# EAGLE design puca-dsp-v1.2-PR (EAGLE 7.6.0)

## Sheet 1 of 3: Power
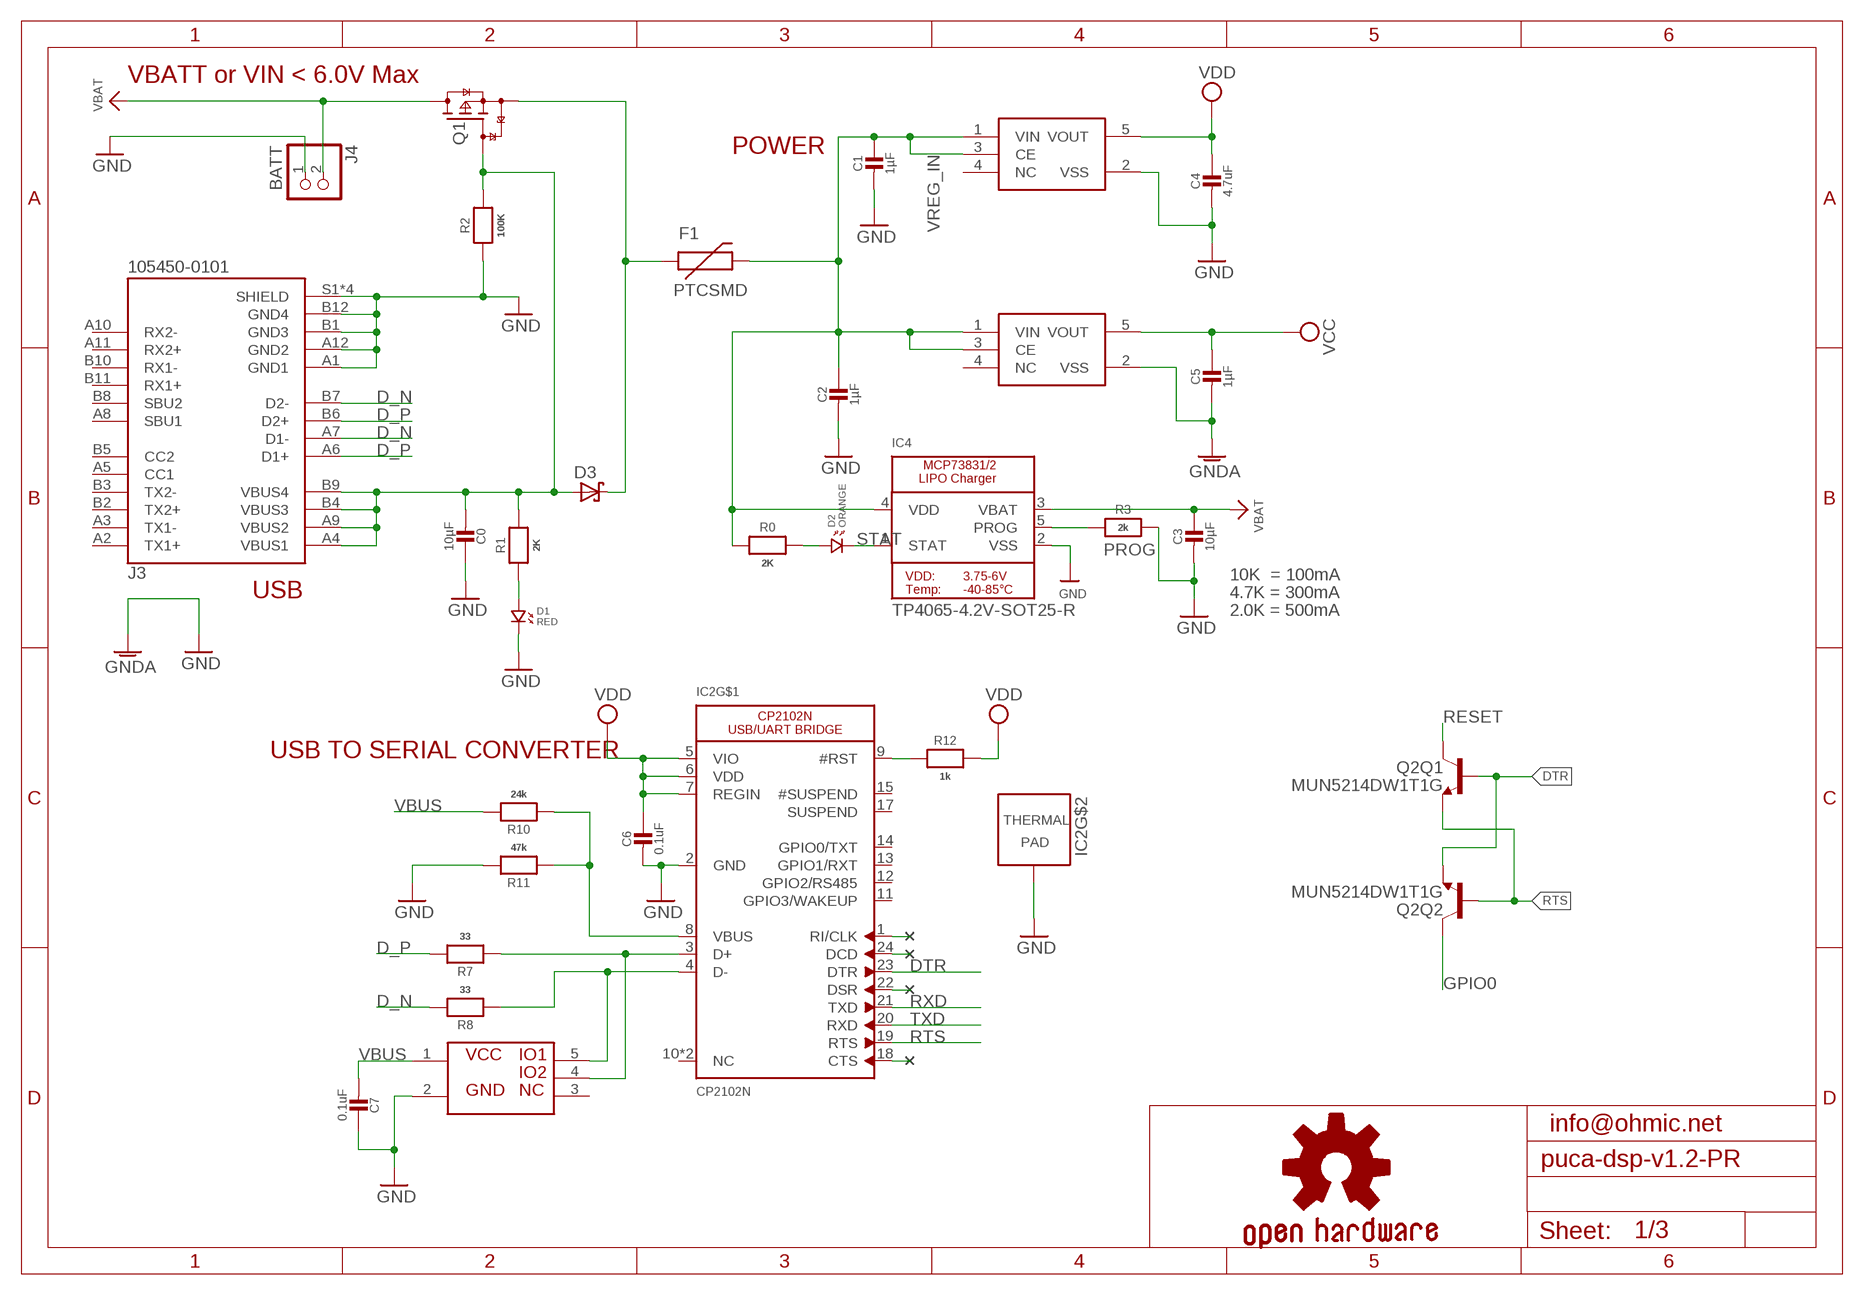
[diagram p0: schematic, sheet 1]

### Parts
C0  10µF  CAP_CERAMIC_0603MP  [_0603MP]
C1  1µF  CAP_CERAMIC_0402MP  [_0402MP]
C2  1µF  CAP_CERAMIC_0402MP  [_0402MP]
C3  10µF  CAP_CERAMIC_0603MP  [_0603MP]
C4  4.7uF  CAP_CERAMIC_0402MP  [_0402MP]
C5  1µF  CAP_CERAMIC_0402MP  [_0402MP]
C6  0.1uF  CAP_CERAMIC_0402MP  [_0402MP]
C7  0.1uF  CAP_CERAMIC_0402MP  [_0402MP]
D1  RED  LED.0402  [0402.LED]
D2  ORANGE  LED.0402  [0402.LED]
D3  BAT60J  [SOD323_ST]
F1  PTCSMD  [PTC-1206]
GOLD_ORB_SM1  OSHWLOGO_GOLD_ORB_SM  [OSHW2]
IC2  CP2102N  CP2102N-A02-GQFN24  [MICROBUILDER_QFN24_4MM_SMSC]
IC4  TP4065-4.2V-SOT25-R  MCP73831/2  [SOT23-5]
IC5  XC6210  [SOT95P285X145-5N]
IC6  XC6210  [SOT95P285X145-5N]
IC8  NUP2114UPXV5T1G  [SOT50P160X60-5N]
J3  105450-0101  [MOLEX_105450-0101]
J4  BATT  JST_2PIN-THM  [JST-PH-2-THM]
Q1  SSM3J56ACT  TINYPICO-P-FETKMB  [SOT883(B)]
Q2  MUN5214DW1T1G  MBT3904DW1T1  [DUAL_NPN_SC70-6]
R0  2K  RESISTOR_0402MP  [_0402MP]
R1  2K  RESISTOR_0402MP  [_0402MP]
R2  100K  RESISTOR_0402MP  [_0402MP]
R3  2k  RESISTOR_0402MP  [_0402MP]
R7  33  RESISTOR_0402MP  [_0402MP]
R8  33  RESISTOR_0402MP  [_0402MP]
R10  24k  RESISTOR_0402MP  [_0402MP]
R11  47k  RESISTOR_0402MP  [_0402MP]
R12  1k  RESISTOR_0402MP  [_0402MP]

### Nets
D1_N: IC2.4(D-) IC8.5 R8.1
D1_P: IC2.3(D+) IC8.4 R7.1
D_N: J3.A7(D1-) J3.B7(D2-) R8.2
D_P: J3.A6(D1+) J3.B6(D2+) R7.2
DTR: IC2.23(DTR) Q2.1(Q2:E) Q2.5(Q1:B)
GND: C0.1 C1.2 C2.2 C3.2 C4.2 C6.2 C7.1 D1.P$2 IC2.2(GND) IC2.THERM(TP) IC4.2(VSS) IC5.2(VSS) IC8.2 J3.A1(GND1) J3.A12(GND2) J3.B1(GND3) J3.B12(GND4) J3.S1(SHIELD) J3.S2(SHIELD) J3.S3(SHIELD) J3.S4(SHIELD) J4.1 R2.2 R3.2 R11.2 ; also sheet 2,3
GNDA: C5.2 IC6.2(VSS) ; supply symbol labelled GND ; also sheet 3
GPIO0: Q2.6(Q2:C) ; also sheet 2,3
N$1: D1.P$1 R1.1
N$2: D2.P$1 R0.2
N$4: IC2.1(RI/CLK)
N$5: IC2.24(DCD)
N$6: IC2.22(DSR)
N$7: IC2.18(CTS)
N$9: IC2.8(VBUS) R10.1 R11.1
N$11: D3.C F1.1 Q1.2(S)
N$13: IC2.9(#RST) R12.1
PROG: IC4.5(PROG) R3.1
RESET: Q2.3(Q1:C) ; also sheet 2
RTS: IC2.19(RTS) Q2.2(Q2:B) Q2.4(Q1:E)
RXD: IC2.21(TXD) ; also sheet 2
STAT: D2.P$2 IC4.1(STAT)
TXD: IC2.20(RXD) ; also sheet 2
VBAT: C3.1 IC4.3(VBAT) J4.2 Q1.3(D) ; also sheet 2
VBUS: C0.2 C7.2 D3.A IC8.1 J3.A4(VBUS1) J3.A9(VBUS2) J3.B4(VBUS3) J3.B9(VBUS4) Q1.1(G) R1.2 R2.1 R10.2
VCC: C5.1 IC6.5(VOUT) ; also sheet 2,3
VDD: C4.1 C6.1 IC2.5(VIO) IC2.6(VDD) IC2.7(REGIN) IC5.5(VOUT) R12.2 ; also sheet 2,3
VREG_IN: C1.1 C2.1 F1.2 IC4.4(VDD) IC5.1(VIN) IC5.3(CE) IC6.1(VIN) IC6.3(CE) R0.1
Unconnected: IC2.10(NC) IC2.11(GPIO3/WAKEUP) IC2.12(GPIO2/RS485) IC2.13(GPIO1/RXT) IC2.14(GPIO0/TXT) IC2.15(#SUSPEND) IC2.16(NC) IC2.17(SUSPEND) IC5.4(NC) IC6.4(NC) IC8.3 J3.A2(TX1+) J3.A3(TX1-) J3.A5(CC1) J3.A8(SBU1) J3.A10(RX2-) J3.A11(RX2+) J3.B2(TX2+) J3.B3(TX2-) J3.B5(CC2) J3.B8(SBU2) J3.B10(RX1-) J3.B11(RX1+)

### Notes on the sheet
- VBATT or VIN < 6.0V Max
- POWER
- 10K  = 100mA
- USB | 4.7K = 300mA
- 2.0K = 500mA
- USB TO SERIAL CONVERTER
- info@ohmic.net

## Sheet 2 of 3: MCU
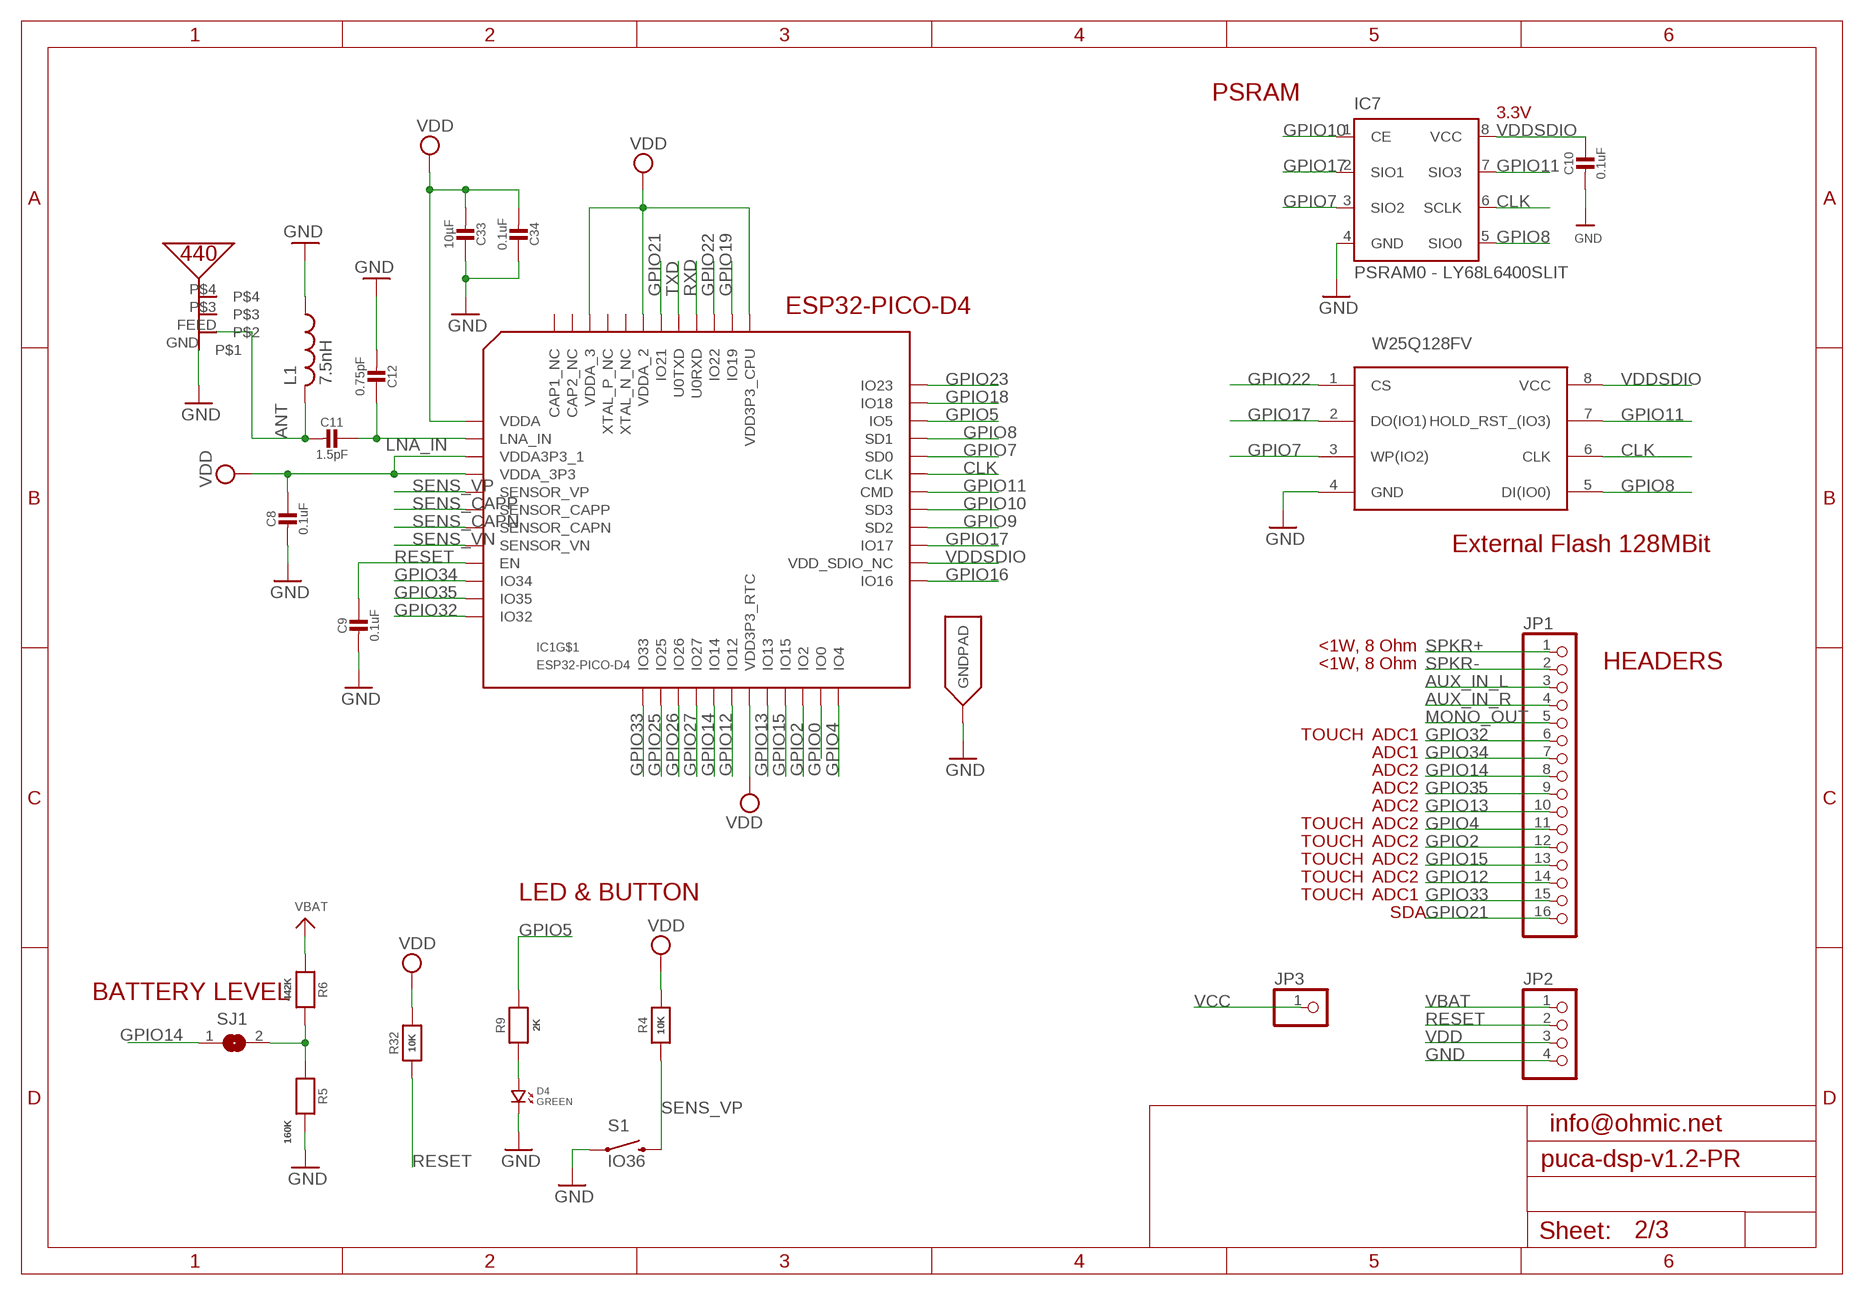
[diagram p1: schematic, sheet 2]

### Parts
C8  0.1uF  CAP_CERAMIC_0402MP  [_0402MP]
C9  0.1uF  CAP_CERAMIC_0402MP  [_0402MP]
C10  0.1uF  CAP_CERAMIC_0402MP  [_0402MP]
C11  1.5pF  CAP_CERAMIC_0402MP  [_0402MP]
C12  0.75pF  CAP_CERAMIC_0402MP  [_0402MP]
C33  10µF  CAP_CERAMIC_0603MP  [_0603MP]
C34  0.1uF  CAP_CERAMIC_0402MP  [_0402MP]
D4  GREEN  LED.0402  [0402.LED]
IC1  ESP32-PICO-D4  [PICO-D4-QFN48]
IC7  PSRAM0 - LY68L6400SLIT  PSRAM0  [SOP8]
IC12  PRO-OB-440  [PRO-OB-440]
JP1  HEADER-1X16ROUND  [1X16_ROUND]
JP2  HEADER-1X4ROUND  [1X04_ROUND]
JP3  HEADER-1X1ROUND  [1X01_ROUND]
L1  7.5nH  INDUCTOR_0402_N  [RESC0402_N]
R4  10K  RESISTOR_0402MP  [_0402MP]
R5  160K  RESISTOR_0402MP  [_0402MP]
R6  442K  RESISTOR_0402MP  [_0402MP]
R9  2K  RESISTOR_0402MP  [_0402MP]
R32  10K  RESISTOR_0402MP  [_0402MP]
S1  IO36  SWITCH-MOMENTARY-2SMD-4.6X2.8MM  [TACTILE_SWITCH_SMD_4.6X2.8MM]
SJ1  SOLDERJUMPER  [SOLDERJUMPER_ARROW_NOPASTE]
U$1  W25Q128FV  [SOIC127P790X216-8N]

### Nets
ANT: C11.2 IC12.FEED L1.2
AUX_IN_L: JP1.3 ; also sheet 3
AUX_IN_R: JP1.4 ; also sheet 3
CLK: IC1.31(CLK) IC7.6(SCLK) U$1.6(CLK)
GND: C8.2 C9.2 C10.2 C12.2 C33.1 C34.1 D4.P$2 IC1.EXP(GNDPAD) IC7.4(GND) IC12.GND JP2.4 L1.1 R5.2 S1.1 S1.2 U$1.4(GND) ; also sheet 1,3
GPIO0: IC1.23(IO0) ; also sheet 1,3
GPIO2: IC1.22(IO2) JP1.12
GPIO4: IC1.24(IO4) JP1.11
GPIO5: IC1.34(IO5) R9.2
GPIO7: IC1.32(SD0) IC7.3(SIO2) U$1.3(WP(IO2))
GPIO8: IC1.33(SD1) IC7.5(SIO0) U$1.5(DI(IO0))
GPIO9: IC1.28(SD2)
GPIO10: IC1.29(SD3) IC7.1(CE)
GPIO11: IC1.30(CMD) IC7.7(SIO3) U$1.7(HOLD_RST_(IO3))
GPIO12: IC1.18(IO12) JP1.14
GPIO13: IC1.20(IO13) JP1.10
GPIO14: IC1.17(IO14) JP1.8 SJ1.1
GPIO15: IC1.21(IO15) JP1.13
GPIO16: IC1.25(IO16)
GPIO17: IC1.27(IO17) IC7.2(SIO1) U$1.2(DO(IO1))
GPIO18: IC1.35(IO18) ; also sheet 3
GPIO19: IC1.38(IO19) ; also sheet 3
GPIO21: IC1.42(IO21) JP1.16
GPIO22: IC1.39(IO22) U$1.1(CS)
GPIO23: IC1.36(IO23) ; also sheet 3
GPIO25: IC1.14(IO25) ; also sheet 3
GPIO26: IC1.15(IO26) ; also sheet 3
GPIO27: IC1.16(IO27) ; also sheet 3
GPIO32: IC1.12(IO32) JP1.6
GPIO33: IC1.13(IO33) JP1.15
GPIO34: IC1.10(IO34) JP1.7
GPIO35: IC1.11(IO35) JP1.9
LNA_IN: C11.1 C12.1 IC1.2(LNA_IN)
MONO_OUT: JP1.5 ; also sheet 3
N$12: R5.1 R6.2 SJ1.2
N$31: D4.P$1 R9.1
RESET: C9.1 IC1.9(EN) JP2.2 R32.1 ; also sheet 1
RXD: IC1.40(U0RXD) ; also sheet 1
SENS_CAPN: IC1.7(SENSOR_CAPN)
SENS_CAPP: IC1.6(SENSOR_CAPP)
SENS_VN: IC1.8(SENSOR_VN)
SENS_VP: IC1.5(SENSOR_VP) R4.1 S1.3 S1.4
SPKR+: JP1.1 ; also sheet 3
SPKR-: JP1.2 ; also sheet 3
TXD: IC1.41(U0TXD) ; also sheet 1
VBAT: JP2.1 R6.1 ; also sheet 1
VCC: JP3.1 ; also sheet 1,3
VDD: C8.1 C33.2 C34.2 IC1.1(VDDA) IC1.3(VDDA3P3_1) IC1.4(VDDA_3P3) IC1.19(VDD3P3_RTC) IC1.37(VDD3P3_CPU) IC1.43(VDDA_2) IC1.46(VDDA_3) JP2.3 R4.2 R32.2 ; also sheet 1,3
VDDSDIO: C10.1 IC1.26(VDD_SDIO_NC) IC7.8(VCC) U$1.8(VCC)
Unconnected: IC1.44(XTAL_N_NC) IC1.45(XTAL_P_NC) IC1.47(CAP2_NC) IC1.48(CAP1_NC) IC12.P$3 IC12.P$4

### Notes on the sheet
- PSRAM
- 3.3V
- ESP32-PICO-D4
- External Flash 128MBit
- <1W, 8 Ohm
- <1W, 8 Ohm | HEADERS
- TOUCH | ADC1
- ADC1
- ADC2
- ADC2
- ADC2
- TOUCH | ADC2
- TOUCH | ADC2
- TOUCH | ADC2
- TOUCH | ADC2
- LED & BUTTON | TOUCH | ADC1
- SDA
- BATTERY LEVEL
- info@ohmic.net

## Sheet 3 of 3: Audio
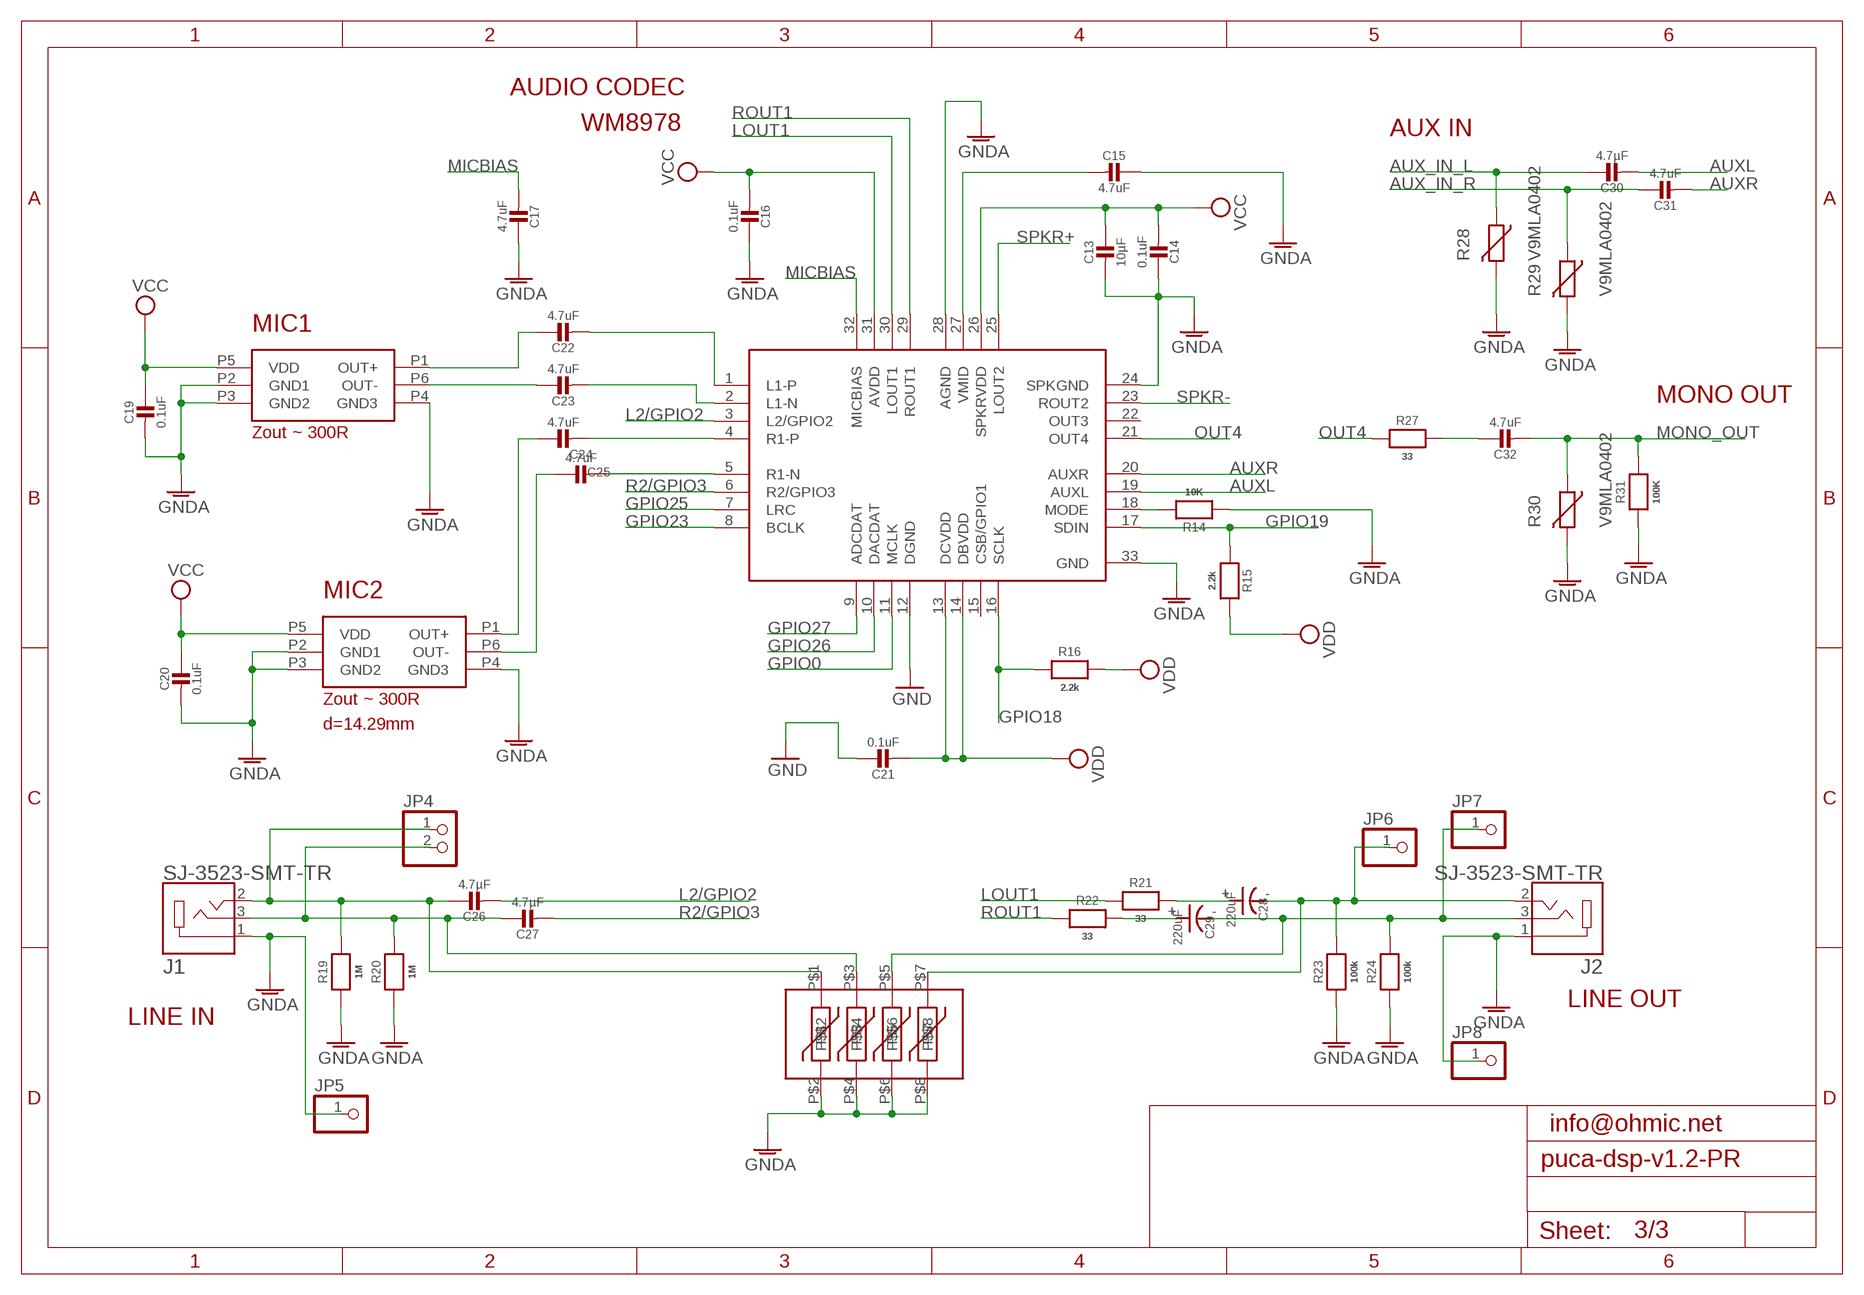
[diagram p2: schematic, sheet 3]

### Parts
C13  10µF  CAP_CERAMIC_0603MP  [_0603MP]
C14  0.1uF  CAP_CERAMIC_0402MP  [_0402MP]
C15  4.7uF  CAP_CERAMIC_0402MP  [_0402MP]
C16  0.1uF  CAP_CERAMIC_0402MP  [_0402MP]
C17  4.7uF  CAP_CERAMIC_0402MP  [_0402MP]
C19  0.1uF  CAP_CERAMIC_0402MP  [_0402MP]
C20  0.1uF  CAP_CERAMIC_0402MP  [_0402MP]
C21  0.1uF  CAP_CERAMIC_0402MP  [_0402MP]
C22  4.7uF  CAP_CERAMIC_0805MP  [_0805MP]
C23  4.7uF  CAP_CERAMIC_0805MP  [_0805MP]
C24  4.7uF  CAP_CERAMIC_0805MP  [_0805MP]
C25  4.7uF  CAP_CERAMIC_0805MP  [_0805MP]
C26  4.7µF  CAP_CERAMIC_0805MP  [_0805MP]
C27  4.7µF  CAP_CERAMIC_0805MP  [_0805MP]
C28  220uF  C3528  [3528]
C29  220uF  C3528  [3528]
C30  4.7µF  CAP_CERAMIC_0805MP  [_0805MP]
C31  4.7uF  CAP_CERAMIC_0805MP  [_0805MP]
C32  4.7uF  CAP_CERAMIC_0805MP  [_0805MP]
IC3  WM8978  [QFN50P500X500X80-33N]
IC9  SPM0687LR5H-1  [SPM0687LR5H-1]
IC10  SPM0687LR5H-1  [SPM0687LR5H-1]
IC11  V18MLN41206WT  [V18MLN41206WT]
J1  SJ-3523-SMT-TR  [CUI_SJ-3523-SMT-TR]
J2  SJ-3523-SMT-TR  [CUI_SJ-3523-SMT-TR]
JP4  HEADER-1X2ROUND  [1X02_ROUND]
JP5  HEADER-1X1ROUND  [1X01_ROUND]
JP6  HEADER-1X1ROUND  [1X01_ROUND]
JP7  HEADER-1X1ROUND  [1X01_ROUND]
JP8  HEADER-1X1ROUND  [1X01_ROUND]
R14  10K  RESISTOR_0402MP  [_0402MP]
R15  2.2k  RESISTOR_0402MP  [_0402MP]
R16  2.2k  RESISTOR_0402MP  [_0402MP]
R19  1M  RESISTOR_0402MP  [_0402MP]
R20  1M  RESISTOR_0402MP  [_0402MP]
R21  33  RESISTOR_0402MP  [_0402MP]
R22  33  RESISTOR_0402MP  [_0402MP]
R23  100k  RESISTOR_0402MP  [_0402MP]
R24  100k  RESISTOR_0402MP  [_0402MP]
R27  33  RESISTOR_0402MP  [_0402MP]
R28  V9MLA0402  VARISTORCN0402  [CT/CN0402]
R29  V9MLA0402  VARISTORCN0402  [CT/CN0402]
R30  V9MLA0402  VARISTORCN0402  [CT/CN0402]
R31  100K  RESISTOR_0402MP  [_0402MP]

### Nets
AUX_IN_L: C30.1 R28.1 ; also sheet 2
AUX_IN_R: C31.1 R29.1 ; also sheet 2
AUXL: C30.2 IC3.19(AUXL)
AUXR: C31.2 IC3.20(AUXR)
GND: C21.1 IC3.12(DGND) ; also sheet 1,2
GNDA: C13.2 C14.1 C15.1 C16.1 C17.1 C19.2 C20.2 IC3.24(SPKGND) IC3.28(AGND) IC3.33(GND) IC9.P2(GND1) IC9.P3(GND2) IC9.P4(GND3) IC10.P2(GND1) IC10.P3(GND2) IC10.P4(GND3) IC11.P$2 IC11.P$4 IC11.P$6 IC11.P$8 J1.1 J2.1 JP5.1 JP8.1 R14.1 R19.1 R20.1 R23.1 R24.1 R28.2 R29.2 R30.2 R31.1 ; also sheet 1
GPIO0: IC3.11(MCLK) ; also sheet 1,2
GPIO18: IC3.16(SCLK) R16.1 ; also sheet 2
GPIO19: IC3.17(SDIN) R15.1 ; also sheet 2
GPIO23: IC3.8(BCLK) ; also sheet 2
GPIO25: IC3.7(LRC) ; also sheet 2
GPIO26: IC3.10(DACDAT) ; also sheet 2
GPIO27: IC3.9(ADCDAT) ; also sheet 2
L1_N: C23.2 IC3.2(L1-N)
L1_P: C22.2 IC3.1(L1-P)
L2/GPIO2: C26.2 IC3.3(L2/GPIO2)
L_N: C23.1 IC9.P6(OUT-)
L_P: C22.1 IC9.P1(OUT+)
LINE_IN_L: C26.1 IC11.P$1 J1.2 JP4.1 R19.2
LINE_IN_R: C27.1 IC11.P$3 J1.3 JP4.2 R20.2
LINE_OUT_L: C28.- IC11.P$7 J2.2 JP6.1 R23.2
LINE_OUT_R: C29.- IC11.P$5 J2.3 JP7.1 R24.2
LOUT1: IC3.30(LOUT1) R21.1
MICBIAS: C17.2 IC3.32(MICBIAS)
MONO_OUT: C32.2 R30.1 R31.2 ; also sheet 2
N$8: C28.+ R21.2
N$10: C29.+ R22.2
N$23: IC3.18(MODE) R14.2
N$25: C32.1 R27.2
N$37: C15.2 IC3.27(VMID)
OUT4: IC3.21(OUT4) R27.1
R1_N: C25.2 IC3.5(R1-N)
R1_P: C24.2 IC3.4(R1-P)
R2/GPIO3: C27.2 IC3.6(R2/GPIO3)
R_N: C25.1 IC10.P6(OUT-)
R_P: C24.1 IC10.P1(OUT+)
ROUT1: IC3.29(ROUT1) R22.1
SPKR+: IC3.25(LOUT2) ; also sheet 2
SPKR-: IC3.23(ROUT2) ; also sheet 2
VCC: C13.1 C14.2 C16.2 C19.1 C20.1 IC3.26(SPKRVDD) IC3.31(AVDD) IC9.P5(VDD) IC10.P5(VDD) ; also sheet 1,2
VDD: C21.2 IC3.13(DCVDD) IC3.14(DBVDD) R15.2 R16.2 ; also sheet 1,2
Unconnected: IC3.15(CSB/GPIO1) IC3.22(OUT3)

### Notes on the sheet
- AUDIO CODEC
- WM8978 | AUX IN
- MIC1
- MONO OUT
- Zout ~ 300R
- MIC2
- Zout ~ 300R
- d=14.29mm
- LINE OUT
- LINE IN
- info@ohmic.net

## Library data of the parts
C0 C1-C17 C19-C27 C30-C34 = microbuilder:CAP_CERAMIC: Ceramic Capacitors 0402 - 0402 Surface Mount Capacitors 16pF 50V 5% [Digikey: 445-4899-2-ND] 18pF 50V 5% [Digikey: 490-1281-2-ND] 22pF 50V 5% [Digikey: 490-1283-2-ND] 68pF 50V 5% [Digikey: 490-1289-2-ND] 0.1uF 10V 10% [Digikey: 490-1318-2-ND] 1.0uF 6.3V 10% [Digikey: 490-1320-2-ND] 0603 - 0603 Surface Mount Capacitors 16 pF 50V 5% [Digikey: 445-5051-2-ND] 22 pF 50V [Digikey: PCC220ACVTR-ND] 33 pF 50V 5% [Digikey: 490-1415-1-ND] 56pF 50V 5% [Digikey: 490-1421-1-ND] 220pF 50V 5% [Digikey: 445-1285-1-ND] 680 pF 50V 2200 pF 50V 5% C0G [Digikey: 445-1297-1-ND] 5600 pF 100V 5% X7R [Digikey: 478-3711-1-ND] 0.1 µF 25V 10% [Digikey: PCC2277TR-ND] 0.22 µF 16V 10% X7R [Digikey: 445-1318-1-ND] 1.0 µF 25V 10% [Digikey: 445-5146-2-ND] 0603 - RF Specific 3pF 250V +/-0.1pF RF [Digikey: 712-1347-1-ND] 18 pF 250V 5% [Digikey: 478-3505-1-ND or 712-1322-1-ND] 56 pF 250V 5% C0G RF [Digikey: 490-4867-1-ND] 68 pF 250V RF [Digikey: 490-4868-1-ND] 0805 - 0805 Surface Mount Capacitors 220 pF 250V 2% RF Ceramic Capacitor [Digikey: 712-1398-1-ND] 1000 pF 50V 2% NP0 Ceramic Capacitor [Digikey: 478-3760-1-ND] 0.1 µF 25V 10% Ceramic Capacitor [Digikey: PCC1828TR-ND] 1.0 µF 16V 10% Ceramic Capacitor[Digikey: 490-1691-2-ND] 10.0 µF 10V 10% Ceramic Capacitor[Digikey: 709-1228-1-ND] 10.0 uF 16V 10% Ceramic Capacitor [Digikey: 478-5165-2-ND] 47 uF 6.3V 20% Ceramic Capacitor [Digikey: 587-1779-1-ND or 399-5506-1-ND] 1206 - 1206 Surface Mount Capacitors 47uF 10V 20% Ceramic Capacitor [Digikey: 490-5528-1-ND or 399-5508-1-ND or 445-6010-1-ND] 100uF 6.3V -20%, +80% Y5V Ceramic Capacitor (Digikey: 490-4512-1-ND, Mouser: 81-GRM31CF50J107ZE1L)
C28 C29 = capsmd:C3528
D1 D2 D4 = cmonr_standardparts:LED
D3 = diode:BAT60J: Schottky barrier diode Source: www.st.com, BAT60J.pdf
F1 = SparkFun-PowerIC:PTC: Resettable Fuse PTC Resettable Fuse. Spark Fun Electronics SKU : COM-08357; PROD_ID: RES-11150
GOLD_ORB_SM1 = bfl:OSHWLOGO: These are Open-Source Hardware logos.
IC1 = UnexpectedMaker:ESP32-PICO-D4
IC2 = CP2104:CP2102N-A02-GQFN24
IC3 = QFN50P500X500X80-33N:WM8978: WM8978 Stereo Codec with Speaker Driver https://www.mouser.com/datasheet/2/76/WM8978_v4.5-1141768.pdf
IC4 = microbuilder:MCP73831/2: MCP73831/2 LIPO Charger VDD: 3.75 - 6V Temp -40 - 85°C Programmable Charge Rate: 15-500mA NOTE: STAT is a tri-state logic output on the MCP73831 and an open-drain output on the MCP73832. SOT23-5 with 4.2V output and tri-state logic on STAT = MCP73831T-2ACI/OT
IC5 IC6 = SOT95P285X145-5N:XC6210
IC7 = UnexpectedMaker:PSRAM: H-bridge driver for brush motors Source: http://www.rohm.com/products/databook/motor/pdf/bd623x_series-e.pdf; MPN: BD6230F-E2; OC_FARNELL: 1716264; OC_NEWARK: 15R0529
IC8 = TPD3E001DRLR:NUP2114UPXV5T1G
IC9 IC10 = mems:SPM0687LR5H-1: Knowles SPM0687LR5H-1 Analog MEMS Microphone. Datasheet: https://media.digikey.com/pdf/Data%20Sheets/Knowles%20Acoustics%20PDFs/SPM0687LR5H-1_DS.pdf
IC11 = VARC3216X102N:V18MLN41206WT
IC12 = UnexpectedMaker:PRO-OB-440
J1 J2 = SJ-3523-SMT-TR:SJ-3523-SMT-TR: Audio Jack Connector 3.5 mm Low Profile Surface Mount Stereo Jack, 3 Pin Right-Angle; AVAILABILITY: Unavailable; CUI_PURCHASE_URL: https://www.cuidevices.com/product/interconnect/connectors/audio-connectors/jacks/sj-352x-smt-series?utm_source=snapeda.com&utm_medium=referral&utm_campaign=snapedaBOM; DESCRIPTION: 3.5 mm, Stereo, Right Angle, Surface Mount (SMT), Audio Jack Connector; DIGIKEY-PURCHASE-URL: https://snapeda.com/shop?store=DigiKey&id=251570; MF: CUI Devices; MOUSER-PURCHASE-URL: https://snapeda.com/shop?store=Mouser&id=251570; MP: SJ-3523-SMT-TR; PACKAGE: LGA-10 STMicroelectronics; PRICE: None
J3 = molex_usb_C_105450-0101:105450-0101: USB Shielded I/O Receptacle; Type C; Right Angle; Surface Mount; Gold over Nickel Check prices <https://pricing.snapeda.com/parts/1054500101/Molex/view-part?ref=eda>; AVAILABILITY: Good; DESCRIPTION: USB-C (USB TYPE-C) USB 3.2 Gen 2 (USB 3.1 Gen 2, Superspeed + (USB 3.1)) Receptacle Connector 24 Position Surface Mount, Right Angle; Through Hole; MF: Molex; MP: 1054500101; PACKAGE: None; PRICE: None; PURCHASE-URL: https://pricing.snapeda.com/search/part/1054500101/?ref=eda
J4 = adafruit:JST_2PIN: JST 2-Pin Connectors of various flavors SMT-RA (S2B-PH-SM4) 4UConnector #17311 SMT (B2B-PH-SM4) THM-RA (S2B-PH) THM (B2B-PH)
JP1 = microbuilder:HEADER-1X16: PIN HEADER
JP2 = microbuilder:HEADER-1X4: PIN HEADER
JP3 JP5-JP8 = microbuilder:HEADER-1X1: PIN HEADER
JP4 = microbuilder:HEADER-1X2: PIN HEADER
L1 = Nordic_nRF:INDUCTOR: Generic chip inductor
Q1 = UnexpectedMaker:TINYPICO-P-FET: 50 V, 150 mA P-channel Trench MOSFET P-channel enhancement mode Field-Effect Transistor (FET) in a small Surface-Mounted Device (SMD) plastic package using Trench MOSFET technology. AAL Eindhoven MK
Q2 = UnexpectedMaker:MBT3904DW1T1: MBT3904DW1 Dual NPN Transistors The MBT3904W1 puts two general purpose 3904 NPN transistors in a single package. Datasheet <http://www.onsemi.com/pub_link/Collateral/MBT3904DW1T1-D.PDF>; PROD_ID: TRANS-13337
R0 R1-R12 R14-R16 R19-R24 R27 R31 R32 = microbuilder:RESISTOR: Resistors 0402 - 0402 Surface Mount Package 22 Ohm 1% 1/16W [Digikey: 311-22.0LRTR-ND] 33 Ohm 5% 1/16W 1.0K 5% 1/16W 1.5K 5% 1/16W 2.0K 1% 1/16W 10.0K 1% 1/16W [Digikey: 311-10.0KLRTR-ND] 10.0K 5% 1/16W [Digikey: RMCF0402JT10K0TR-ND] 12.1K 1% 1/16W [Digikey: 311-22.0LRTR-ND] 100.0K 5% 1/16W 0603 - 0603 Surface Mount Package 0 Ohm 1/10 Watt 1% Resistor 15 Ohm 1/10 Watt 1% Resistor 33 Ohm 1/10 Watt 1% Resistor 49.9 Ohm 1/10 Watt 1% Resistor 100 Ohm 1/10 Watt 1% Resistor 150 Ohm 1/10 Watt 1% Resistor 240 Ohm 1/10 Watt 1% Resistor 390 Ohm 1/10 Watt 1% Resistor 560 Ohm 1/10 Watt 1% Resistor 680 Ohm 1/10 Watt 1% Resistor 750 Ohm 1/10 Watt 1% Resistor 1.0K Ohm 1/10 Watt 1% Resistor 1.5K Ohm 1/10 Watt 1% Resistor 2.0K Ohm 1/10 Watt 1% Resistor 2.2K Ohm 1/10 Watt 1% Resistor 3.3K Ohm 1/10 Watt 1% Resistor 4.7K Ohm 1/10 Watt 1% Resistor 10.0K Ohm 1/10 Watt 1% Resistor 12.0K Ohm 1/10 Watt 1% Resistor 12.1K Ohm 1/10 Watt 1% Resistor 20.0K Ohm 1/10 Watt 1% Resistor 33.0K Ohm 1/10 Watt 1% Resistor 100.0K Ohm 1/10 Watt 1% Resistor 0805 - 0805 Surface Mount Package 0 Ohm 1/8 Watt 1% Resistor 33 Ohm 1/8 Watt 1% Resistor 100 Ohm 1/8 Watt 1% Resistor 150 Ohm 1/8 Watt 1% Resistor 200 Ohm 1/8 Watt 1% Resistor 240 Ohm 1/8 Watt 1% Resistor 330 Ohm 1/8 Watt 1% Resistor 390 Ohm 1/8 Watt 1% Resistor 470 Ohm 1/8 Watt 1% Resistor 1.0K Ohm 1/8 Watt 1% Resistor 1.5K Ohm 1/8 Watt 1% Resistor 2.0K Ohm 1/8 Watt 1% Resistor 4.7K Ohm 1/8 Watt 1% Resistor 5.1K Ohm 1/8 Watt 1% Resistor 5.6K Ohm 1/8 Watt 1% Resistor 10.0K Ohm 1/8 Watt 1% Resistor 22.0K Ohm 1/8 Watt 1% Resistor 33.0K Ohm 1/8 Watt 1% Resistor 100K Ohm 1/8 Watt 1% Resistor 1206 - 1206 Surface Mount Package 2012 - 2010 Surface Mount Package 0.11 Ohm 1/2 Watt 1% Resistor - Digikey: RHM.11UCT-ND
R28-R30 = varistor:VARISTOR: VARISTOR
S1 = SparkFun-Electromechanical:SWITCH-MOMENTARY-2: Various NO switches- pushbuttons, reed, etc; PROD_ID: SWCH-13065
SJ1 = microbuilder:SOLDERJUMPER: SMD Solder JUMPER Solder the two pads together to create a connection, or remove the solder to break it. REFLOW - Use this footprint for solder paste and reflow ovens. WAVE - Use this footprint for hand-soldering (larger pads). CLOSED - Has a trace between the two pads to ensure it is closed by default. The trace needs to be cut to disable the jumper, and can be closed again by creating a solder bridge between the two pads.; BOM: EXCLUDE
U$1 = SOIC127P790X216-8N:W25Q128FV

## Board
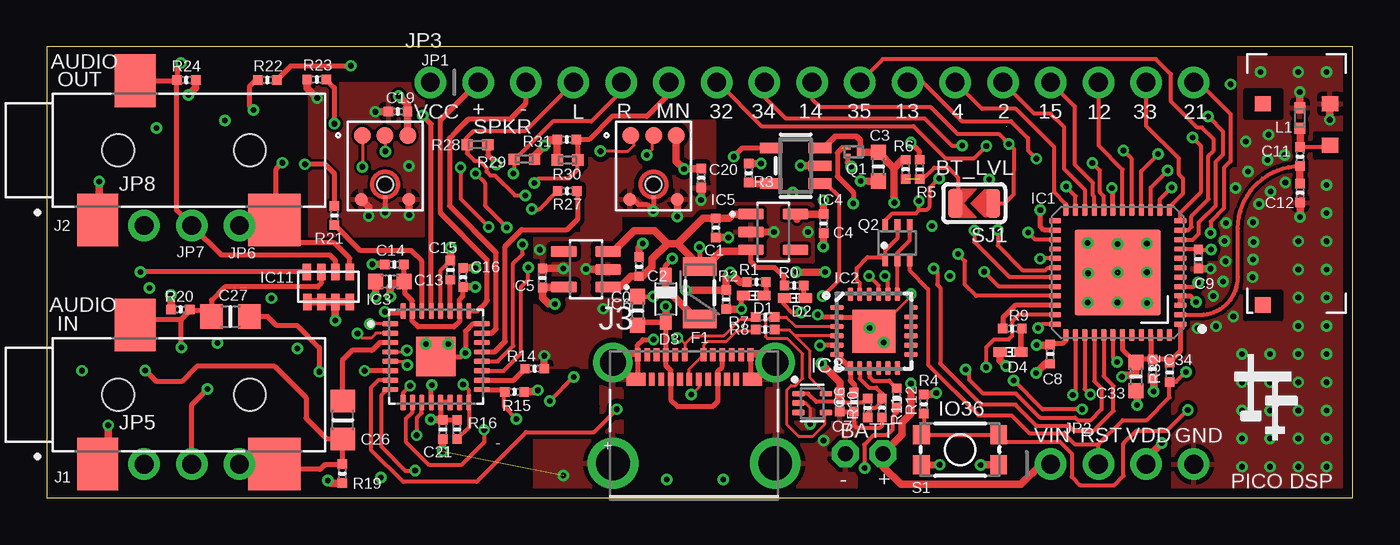
[diagram p3: board, top side]
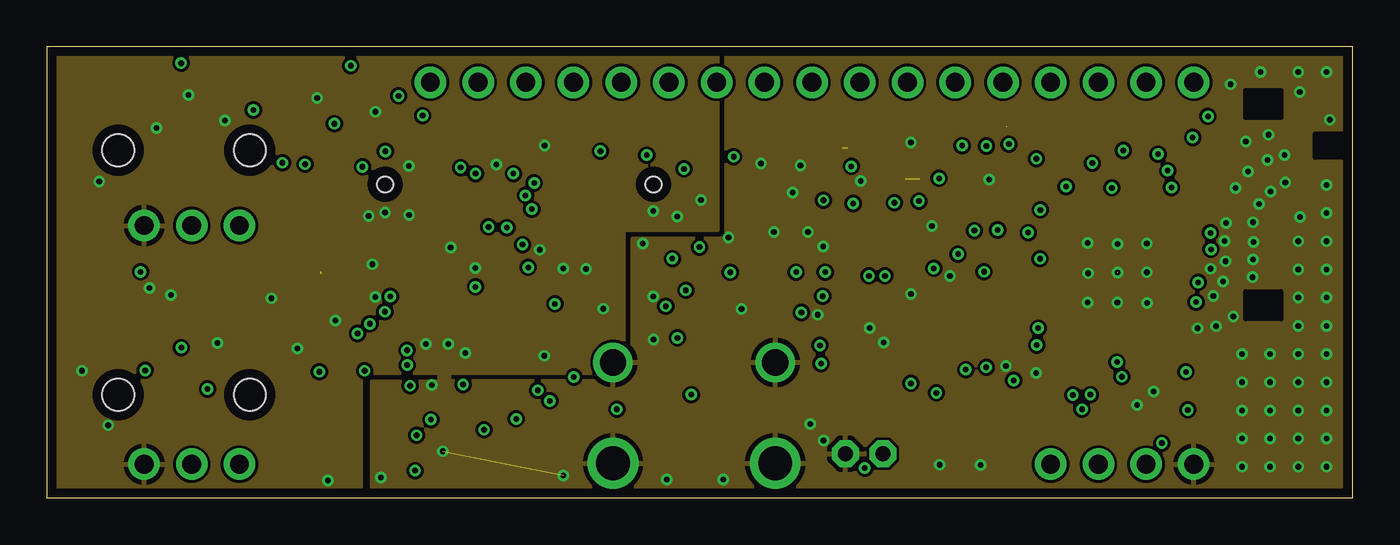
[diagram p4: board, inner layer GND]
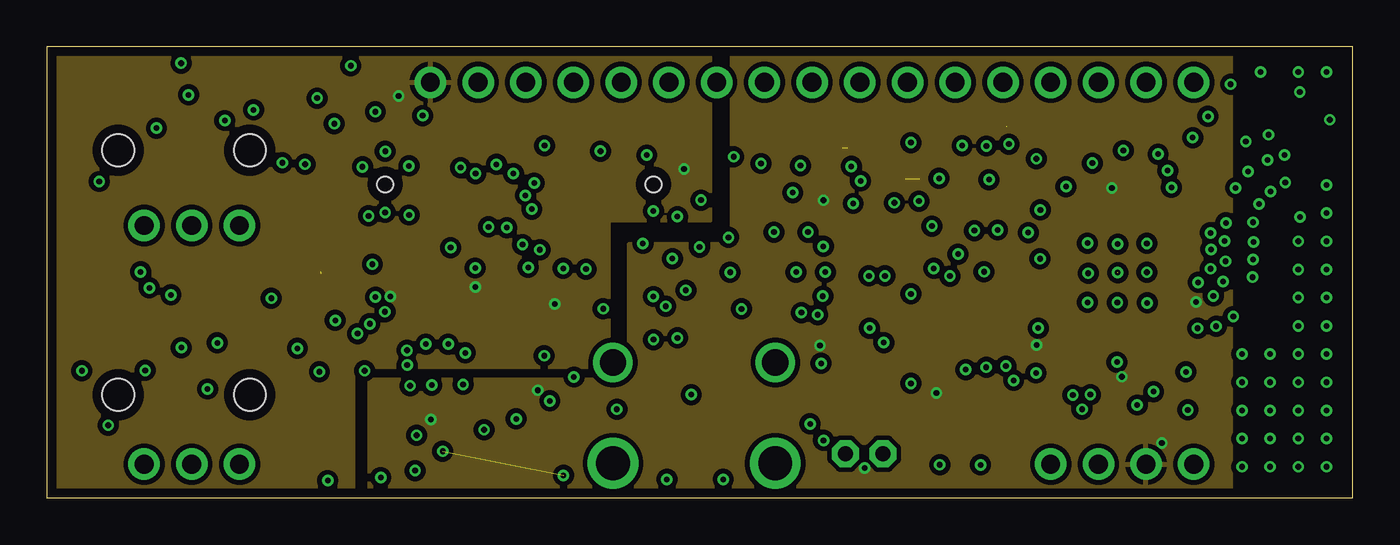
[diagram p5: board, inner layer VCC]
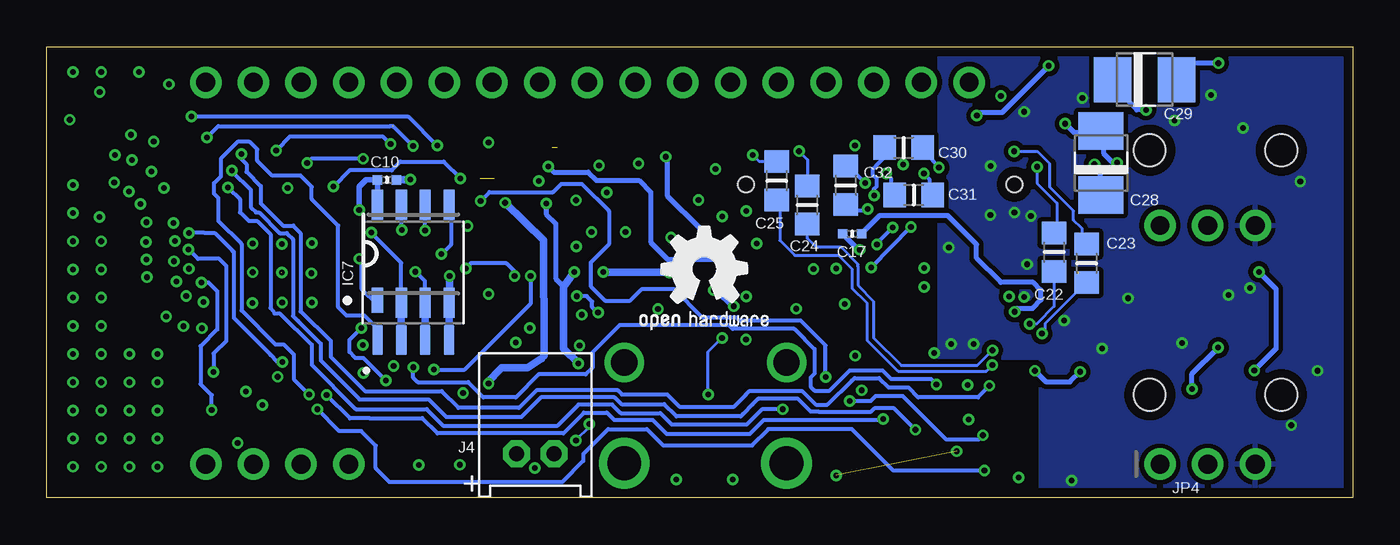
[diagram p6: board, bottom side, seen from below]

Size 69.5 x 24 mm. Coordinates in mm from the lower left corner, seen from the top.
Outline: 0,0 69.5,0 69.5,24 0,24 0,0
Copper layers (1*2*15*16): Top_Signal 0.035mm / dielectric 0.11mm / GND 0.035mm / dielectric 1.13mm / VCC 0.035mm / dielectric 0.11mm / Bottom_Signal 0.035mm
Design rules "PICO_DSP_4-layer": minimum track width 6mil, minimum drill 12mil, track to track 6mil, track to pad 6mil, pad to pad 6mil, via to via 6mil, smd to smd 0mil, copper to edge 20mil, drill to drill 10mil, minimum pad ring 6mil, minimum via ring 6mil, stop-mask expansion 0mil, vias tented up to drill 100mil, thermal gap 10mil

### Footprints (pad centres in the part's own frame; a part is rotated, then mirrored left to right if it is on the bottom)
_0603MP = smd 0.8 x 0.8: 1 -0.762,0; 2 0.762,0
_0402MP = smd 0.5 x 0.5: 1 -0.508,0; 2 0.508,0
_0805MP = smd 1.2 x 1.3: 1 -1.016,0; 2 1.016,0
3528 = smd 2.007 x 2.388: + -1.702,0; - 1.702,0
0402.LED = smd 0.7 x 0.5: P$1 -0.55,0; P$2 0.55,0
SOD323_ST = smd 0.8 x 0.6: A 1.25,0; C -1.25,0
PTC-1206 = smd 1 x 1.8: 1 -1.4,0; 2 1.4,0
PICO-D4-QFN48 = smd 0.66 x 0.3: 1 -3.327,2.75; 2 -3.327,2.25; 3 -3.327,1.75; 4 -3.327,1.25; 5 -3.327,0.75; 6 -3.327,0.25; 7 -3.327,-0.25; 8 -3.327,-0.75; 9 -3.327,-1.25; 10 -3.327,-1.75; 11 -3.327,-2.25; 12 -3.327,-2.75; 25 3.327,-2.75; 26 3.327,-2.25; 27 3.327,-1.75; 28 3.327,-1.25; 29 3.327,-0.75; 30 3.327,-0.25; 31 3.327,0.25; 32 3.327,0.75; 33 3.327,1.25; 34 3.327,1.75; 35 3.327,2.25; 36 3.327,2.75 | smd 0.3 x 0.66: 13 -2.75,-3.327; 14 -2.25,-3.327; 15 -1.75,-3.327; 16 -1.25,-3.327; 17 -0.75,-3.327; 18 -0.25,-3.327; 19 0.25,-3.327; 20 0.75,-3.327; 21 1.25,-3.327; 22 1.75,-3.327; 23 2.25,-3.327; 24 2.75,-3.327; 37 2.75,3.327; 38 2.25,3.327; 39 1.75,3.327; 40 1.25,3.327; 41 0.75,3.327; 42 0.25,3.327; 43 -0.25,3.327; 44 -0.75,3.327; 45 -1.25,3.327; 46 -1.75,3.327; 47 -2.25,3.327; 48 -2.75,3.327 | smd 4.572 x 4.572: EXP 0,0
MICROBUILDER_QFN24_4MM_SMSC = smd 0.737 x 0.28: 1 -1.968,1.25; 2 -1.968,0.75; 3 -1.968,0.25; 4 -1.968,-0.25; 5 -1.968,-0.75; 6 -1.968,-1.25; 13 1.968,-1.25; 14 1.968,-0.75; 15 1.968,-0.25; 16 1.968,0.25; 17 1.968,0.75 | smd 0.28 x 0.737: 7 -1.25,-1.968; 8 -0.75,-1.968; 9 -0.25,-1.968; 10 0.25,-1.968; 11 0.75,-1.968; 12 1.25,-1.968; 19 1.25,1.968; 20 0.75,1.968; 21 0.25,1.968; 22 -0.25,1.968; 23 -0.75,1.968; 24 -1.25,1.968 | smd 0.457 x 0.28: 18 2.095,1.25 | smd 2.286 x 2.286: THERM 0,0
QFN50P500X500X80-33N = smd 0.84 x 0.27: 1 -2.435,1.75; 2 -2.435,1.25; 3 -2.435,0.75; 4 -2.435,0.25; 5 -2.435,-0.25; 6 -2.435,-0.75; 7 -2.435,-1.25; 8 -2.435,-1.75; 17 2.435,-1.75; 18 2.435,-1.25; 19 2.435,-0.75; 20 2.435,-0.25; 21 2.435,0.25; 22 2.435,0.75; 23 2.435,1.25; 24 2.435,1.75 | smd 0.27 x 0.84: 9 -1.75,-2.435; 10 -1.25,-2.435; 11 -0.75,-2.435; 12 -0.25,-2.435; 13 0.25,-2.435; 14 0.75,-2.435; 15 1.25,-2.435; 16 1.75,-2.435; 25 1.75,2.435; 26 1.25,2.435; 27 0.75,2.435; 28 0.25,2.435; 29 -0.25,2.435; 30 -0.75,2.435; 31 -1.25,2.435; 32 -1.75,2.435 | smd 2.1 x 2.1: 33 0,0
SOT23-5 = smd 0.55 x 1.2: 1 -0.95,-1.3; 2 0,-1.3; 3 0.95,-1.3; 4 0.95,1.3; 5 -0.95,1.3
SOT95P285X145-5N = smd 1.37 x 0.59: 1 -1.175,0.95; 2 -1.175,0; 3 -1.175,-0.95; 4 1.175,-0.95; 5 1.175,0.95
SOP8 = smd 0.6 x 1.346: 1 -1.905,-2.473 | smd 0.6 x 1.6: 2 -0.635,-2.6; 3 0.635,-2.6; 4 1.905,-2.6; 5 1.905,2.6; 6 0.635,2.6; 7 -0.635,2.6; 8 -1.905,2.6
SOT50P160X60-5N = smd 0.66 x 0.3: 1 -0.735,0.5; 2 -0.735,0; 3 -0.735,-0.5; 4 0.735,-0.5; 5 0.735,0.5
SPM0687LR5H-1 = smd 0.9 x 0.9: P1 -1.204,0; P5 1.204,0; P6 0,0 | smd 0.7 x 0.7: P2 -1.265,-3.406; P4 1.265,-3.406 | smd 0.305 x 0.152: P3 0,-3.302 | hole 0.85: 0,-2.616
V18MLN41206WT = smd 0.457 x 0.889: P$1 -1.143,0.8; P$2 -1.118,-0.8; P$3 -0.381,0.8; P$4 -0.381,-0.8; P$5 0.381,0.8; P$6 0.381,-0.8; P$7 1.143,0.8; P$8 1.143,-0.8
PRO-OB-440 = smd 0.8 x 0.86: FEED 8.9,-4.4; GND 11.1,-4.4; P$3 11.1,-0.83; P$4 0.4,-0.83
CUI_SJ-3523-SMT-TR = smd 2.2 x 2.8: 1 -1.1,-3.7; 3 0.9,3.7 | smd 2.8 x 2.8: 2 8.3,-3.7 | hole 1.7: 0,0; 7,0
MOLEX_105450-0101 = smd 0.3 x 0.7: A1 -3,3.77; A2 -2.5,3.77; A3 -2,3.77; A4 -1.5,3.77; A5 -1,3.77; A6 -0.5,3.77; A7 0.5,3.77; A8 1,3.77; A9 1.5,3.77; A10 2,3.77; A11 2.5,3.77; A12 3,3.77; B2 2.25,2.47; B3 1.75,2.47; B4 1.25,2.47; B5 0.75,2.47; B6 0.25,2.47; B7 -0.25,2.47; B8 -0.75,2.47; B9 -1.25,2.47; B10 -1.75,2.47; B11 -2.25,2.47 | smd 1 x 0.7: B1 3.1,2.47; B12 -3.1,2.47 | drill 1.4 pad 2.1: S1 -4.32,3.36; S2 4.32,3.36 | drill 1.8 pad 2.45: S3 -4.32,-2; S4 4.32,-2
JST-PH-2-THM = drill 0.8 pad 1.422 octagon: 1 1,0; 2 -1,0
1X16_ROUND = drill 1 pad 1.676: 1 -19.05,0; 2 -16.51,0; 3 -13.97,0; 4 -11.43,0; 5 -8.89,0; 6 -6.35,0; 7 -3.81,0; 8 -1.27,0; 9 1.27,0; 10 3.81,0; 11 6.35,0; 12 8.89,0; 13 11.43,0; 14 13.97,0; 15 16.51,0; 16 19.05,0
1X04_ROUND = drill 1 pad 1.676: 1 -3.81,0; 2 -1.27,0; 3 1.27,0; 4 3.81,0
1X01_ROUND = drill 1 pad 1.676: 1 0,0
1X02_ROUND = drill 1 pad 1.676: 1 -1.27,0; 2 1.27,0
RESC0402_N = smd 0.6 x 0.6: 1 -0.55,0; 2 0.55,0
SOT883(B) = smd 0.4 x 0.25: 1 -0.35,0.225; 2 -0.35,-0.225 | smd 0.4 x 0.7: 3 0.35,0
DUAL_NPN_SC70-6 = smd 0.3 x 0.66: 1 -0.65,-0.92; 2 0,-0.92; 3 0.65,-0.92; 4 0.65,0.92; 5 0,0.92; 6 -0.65,0.92
CT/CN0402 = smd 0.6 x 0.6: 1 -0.55,0; 2 0.55,0
TACTILE_SWITCH_SMD_4.6X2.8MM = smd 0.9 x 1: 1 -2.05,-0.8; 2 2.05,-0.8; 3 2.05,0.8; 4 -2.05,0.8
SOLDERJUMPER_ARROW_NOPASTE = smd 0.762 x 1.524: 1 -1.016,0; 2 1.016,0
SOIC127P790X216-8N = smd 1.61 x 0.58: 1 -3.605,1.905; 2 -3.605,0.635; 3 -3.605,-0.635; 4 -3.605,-1.905; 5 3.605,-1.905; 6 3.605,-0.635; 7 3.605,0.635; 8 3.605,1.905

### Placement (x,y rotation side)
C0  31.44,9.96 270 top
C1  35.61,14.38 270 top
C2  31.52,12.31 90 top
C3  44.26,17.63 270 top
C4  41.34,14.6 270 top
C5  26.38,11.71 90 top
C6  42.96,5.1 270 top
C7  42.21,5.1 90 top
C8  53.41,7.65 270 top
C9  61.29,12.71 270 top
C10  51.4,16.93 0 bottom
C11  66.71,18.17 90 top
C12  66.7,16.23 270 top
C13  18.26,11.52 180 top
C14  18.49,12.43 0 top
C15  21.48,12.12 270 top
C16  22.15,11.74 270 top
C17  26.64,14.06 0 bottom
C19  18.69,20.57 180 top
C20  34.83,17.03 270 top
C21  21.07,3.65 90 top
C22  15.89,13.08 270 bottom
C23  14.16,12.49 270 bottom
C24  29.04,15.59 270 bottom
C25  30.66,16.88 270 bottom
C26  15.75,4.15 90 top
C27  9.76,9.66 0 top
C28  13.39,17.83 90 bottom
C29  11.07,22.26 0 bottom
C30  23.9,18.64 0 bottom
C31  23.36,16.13 0 bottom
C32  26.97,16.64 90 bottom
C33  57.97,6.47 90 top
C34  58.86,6.87 90 top
D1  37.62,10.77 180 top
D2  39.81,10.64 180 top
D3  32.94,10.59 270 top
D4  51.29,7.76 180 top
F1  34.75,10.92 90 top
GOLD_ORB_SM1  38.33,7.9 0 bottom
IC1  57,12 180 top
IC2  44.02,8.88 0 top
IC3  20.71,7.52 0 top
IC4  39.85,17.68 90 top
IC5  38.66,14.16 0 top
IC6  28.69,12.17 180 top
IC7  50,13 0 bottom
IC8  40.74,5.05 0 top
IC9  18,19.3 0 top
IC10  32.29,19.3 0 top
IC11  14.98,11.23 0 top
IC12  63.9,9.87 90 top
J1  3.8,5.5 0 top
J2  3.8,18.5 0 top
J3  34.45,3.85 0 top
J4  43.5,2.36 0 bottom
JP1  42,22.12 0 top
JP2  57.24,1.8 0 top
JP3  20.41,22.12 0 top
JP4  8.98,1.8 0 bottom
JP5  5.17,1.8 0 top
JP6  10.25,14.5 0 top
JP7  7.71,14.5 0 top
JP8  5.17,14.5 0 top
L1  66.69,20.22 270 top
Q1  42.95,18.42 0 top
Q2  45.27,13.57 0 top
R0  39.77,11.31 0 top
R1  37.77,11.49 180 top
R2  36.15,10.55 270 top
R3  37.35,17.29 90 top
R4  46.68,5 90 top
R5  46.45,17.49 90 top
R6  45.71,17.49 270 top
R7  38.24,9.63 180 top
R8  38.24,8.97 180 top
R9  51.39,9.01 180 top
R10  43.68,4.79 90 top
R11  44.45,4.79 270 top
R12  45.23,5.33 270 top
R14  25.96,6.88 180 top
R15  24.89,5.65 0 top
R16  21.83,3.65 90 top
R19  15.73,1.3 90 top
R20  7.11,10.04 0 top
R21  15.31,15.04 90 top
R22  11.74,22.25 180 top
R23  14.36,22.27 0 top
R24  7.42,22.24 180 top
R27  27.69,16.34 180 top
R28  22.92,18.8 0 top
R29  25.41,18.03 0 top
R30  27.71,17.98 180 top
R31  27.67,19.07 0 top
R32  59.76,6.69 90 top
S1  48.61,2.57 0 top
SJ1  49.36,15.68 180 top
U$1  50,12 90 bottom

### Tracks (layer width: path | path; a pad name or v marks a point on that pad's centre or on a via)
ANT
  Top_Signal 0.215: C11.2 68.21,18.68
  Top_Signal 0.406: C11.2 arc90 C11.2 66.71,19.65 arc90 L1.2 | 68.21,18.68 IC12.FEED
AUX_IN_L  (via drill 0.3)
  Top_Signal 0.2: JP1.3 28.03,22.1 25.45,19.52 22.7,19.52 | 22.31,18.86 22.31,19.14 22.69,19.52 22.7,19.52 | 22.31,18.86 R28.1 | 22.31,18.86 22.31,18.85 22.38,18.78 22.38,18.32 | 22.38,18.32 22.76,17.94 23.02,17.94 23.39,17.57 23.39,17.38 23.6,17.17 23.84,17.17 24.91,16.1 v25.47,16.1 | 22.7,19.52 22.32,19.14 22.32,18.73 22.36,18.69 22.36,18.34 22.38,18.32
  Bottom_Signal 0.2: C30.1 24.92,18.58 25,18.5 25,18.05 25.35,17.7 25.35,17.69 25.52,17.52 25.52,17.17 25.33,16.98 25.33,16.59 25.47,16.45 v25.47,16.1
AUX_IN_R  (via drill 0.3)
  Top_Signal 0.2: JP1.4 30.57,21.63 28.98,20.04 26.93,20.04 24.95,18.05 24.78,17.89 | R29.1 24.86,17.29 v24.83,17.26
  Top_Signal 0.254: R29.1 24.92,18.03 24.95,18.05
  Bottom_Signal 0.2: C31.1 24.55,16.39 24.55,16.98 v24.83,17.26
AUXL  (via drill 0.3)
  Top_Signal 0.2: IC3.19 24.31,6.77 25.25,7.71 25.25,11.24 25.62,11.61 v25.62,12.27 | 23.23,14.71 v23.51,14.43 22.02,15.92 v22.02,17.58
  Bottom_Signal 0.2: v25.62,12.27 v23.51,14.43 | 23.35,18.87 C30.2 22.54,18.3 22.54,18.2 v22.02,17.58
AUXR  (via drill 0.3)
  Top_Signal 0.2: IC3.20 23.99,7.27 24.82,8.1 24.82,12.48 25.32,12.98 v25.32,13.48 | 24.41,14.46 v24.48,14.39 23.31,15.56 23.31,16.77 v22.82,17.26
  Bottom_Signal 0.2: v25.32,13.48 25.32,13.55 v24.48,14.39 | C31.2 22.33,16.17 22.5,16 22.5,16.93 v22.82,17.26
CLK  (via drill 0.3)
  Top_Signal 0.2: IC1.31 51.25,11.75 49.37,13.63 v49.37,14.23
  Bottom_Signal 0.2: v49.37,14.23 IC7.6 U$1.6
D1_N
  Top_Signal 0.152: R8.1 38.79,8.93 39.53,8.93 39.79,8.67 | 39.79,8.67 42.01,8.67 IC2.4 | 39.79,8.67 40.63,7.83 40.63,6.39 IC8.5
D1_P
  Top_Signal 0.152: 42.13,9.06 42.11,9.06 42.05,9.12 IC2.3 39.84,9.14 39.35,9.63 R7.1 38.48,9.63 38.24,9.39 38.24,8.6 38.35,8.49 39.4,8.49 40.22,7.67 40.22,6.36 39.93,6.07 39.84,5.98 39.61,5.98 39.37,5.74 39.37,3.93 40.03,3.27 40.75,3.27 41.41,3.93 41.41,4.49 IC8.4
D_N
  Top_Signal 0.152: R8.2 37.65,8.89 36.73,8.89 36.14,8.31 35.15,8.31 34.96,8.12 34.96,7.56 J3.A7 34.19,6.86 34.19,6.76 J3.B7
D_P  (via drill 0.3)
  Top_Signal 0.152: 33.97,8.22 34.37,8.61 36.02,8.61 36.91,9.51 37.61,9.51 R7.2 | 33.97,8.22 33.97,7.57 J3.A6 33.95,7.82 33.98,7.85 | J3.B6 34.7,5.9 v34.3,5.5 | v33.56,8.52 33.67,8.52 33.97,8.22
  Bottom_Signal 0.152: v34.3,5.5 34.3,7.78 v33.56,8.52
DTR
  Top_Signal 0.2: Q2.5 45.27,13.82 44.61,13.16 Q2.1 44.45,12.82 43.69,12.82 43.11,12.23 43.11,11.59 43.27,11.43 IC2.23
GND  (via drill 0.3)  (2 unrouted)
  Top_Signal 0.152: v45.99,10.86 45.99,10.73 44.92,9.66 44.8,9.66 IC2.THERM | IC8.2 40.38,5.05 40.63,4.8 v40.63,3.94
  Top_Signal 0.2: C6.2 42.95,3.87 42.98,3.87 43.09,3.76 43.1,3.76 43.12,3.74 44.34,3.74 44.45,3.85 R11.2 | 44.47,4.15 44.46,4.15
  Top_Signal 0.254: 41.05,9.75 v41.03,9.75 41.23,9.63 IC2.2 43.27,9.63 IC2.THERM 44.28,8.88 | 44.5,16.86 C3.2 | IC3.12 20.46,5.99 v20.48,6.01 | J3.A1 31.45,6.35 J3.B12 | J3.B1 37.45,6.35 J3.A12 38.36,7.61 J3.S2 | J3.A1 30.54,7.6 J3.S1 | v36.97,10.06 36.97,10.67 D1.P$2 | J3.A1 31.45,8.15 31.72,8.43 v32.29,8.43 | C0.1 31.52,10.72 v32.28,10.72 | R5.2 46.45,18.45 v45.99,18.91 | C7.1 42.91,4.59 43,4.5 | R11.2 44.47,4.15 | C6.2
  Top_Signal 0.406: 21.07,3.15 C21.1 v21.07,2.49 | 31.58,10.7 C0.1 | IC5.2 v38.7,14.15 | v47.53,1.77 46.54,1.75 S1.1 | v49.7,1.76 S1.2 | 37.21,10.76 D1.P$2 | IC4.2 v40.11,17.69 | R3.2 37.86,17.8 v38.01,17.8 | C3.2 43.72,16.87 v43.31,16.87 | v58.91,5.66 58.92,6.36 C34.1 | v58.04,4.95 58.04,5.68 C33.1 | v61.94,12.2 C9.2 | D4.P$2 50.74,7.33 v51.05,7.02 | 53.4,7.13 C8.2 53.14,7.14 v52.65,6.65 | v66.71,14.95 C12.2 | v68.29,20.13 68.29,20.89 IC12.GND | L1.1 v66.69,21.6 66.69,21.63 | C1.2 35.81,13.87 v36.28,13.87 | C2.2 31.51,12.85 31.51,13.33 v31.72,13.54 | R2.2 36.96,10.05 v36.97,10.06 | C4.2 v41.34,13.4 v41.33,13.39
  Bottom_Signal 0.152: v40.63,3.94 40.63,3.78 v41.35,3.06
  Bottom_Signal 0.406: v48.07,11.81 48.06,11.27 IC7.4 U$1.4 | C10.2 50.24,16.93 v50.15,16.94
  other vias: 17.77,1.09 27.49,1.2 55.39,13.56 57,13.51 58.55,13.55 58.55,12.01 57,11.99 55.43,11.96 55.39,10.41 56.98,10.4 58.57,10.38 61.26,9.03 62.24,9.14 63.15,9.66 62.09,10.75 62.6,11.52 62.74,12.6 62.69,13.68 62.76,14.64 63.28,16.5 63.93,17.38 64.97,17.99 65.88,18.26 64.17,11.75 64.21,12.69 64.24,13.62 64.21,14.67 64.52,15.64 65.14,16.3 65.92,16.79 66.61,13.66 68.11,13.66 68.11,15.16 68.11,16.66 66.61,12.16 68.11,12.16 68.11,10.66 66.61,10.66 66.61,9.16 68.11,9.16 68.11,7.66 68.11,6.16 68.11,4.66 68.11,3.16 68.11,1.66 66.61,1.66 66.61,3.16 66.61,4.66 66.61,6.16 66.61,7.66 65.11,7.66 63.61,7.66 65.11,6.16 63.61,6.16 65.11,4.66 65.11,3.16 65.11,1.66 63.61,4.66 63.61,3.16 63.61,1.66 65.02,19.33 64.61,22.66 66.61,22.66 68.11,22.66 63.82,18.97 63.01,22.02 47.11,14.47 39.7,16.25 43.79,9.04 44.55,8.27 40.51,14.15 33,0.99 36,0.99
  pour GND: 21.5,0 21.5,6.2 31.2,6.2 31.2,13.8 36.2,13.8 36.2,24 69.5,24 69.5,0
  pour GND: 21.4,0 17.3,0 17.3,6.2 20.9,6.2 20.9,7 21.4,7
  pour Top_Signal (isolate 0.254): 26,0 26,3.5 29.58,3.42 29.55,6.4 43,6 43,0
  pour Top_Signal: 40.75,12.6 40.72,15.6 36.64,15.6 36.66,12.67
  pour Top_Signal (isolate 0.2): 60,0 60,12.5 62.5,12.5 62.5,17.5 63.5,17.5 63.5,24 69.5,24 69.5,0
GNDA  (via drill 0.3)
  Top_Signal 0.2: IC3.28 20.96,12.13 21.46,12.63 C15.1
  Top_Signal 0.254: IC3.33 22.07,7.52 v22.27,7.72 v22.28,7.73 22.28,8.88 22.67,9.27 IC3.24 | IC9.P3 v18,15.2 | IC10.P3 v32.29,15.28 | R28.2 23.47,18.24 v23.93,17.75 | 3.23,1.27 3.23,1.63 3.56,1.96 | IC10.P2 31.22,15.89 31.49,15.62 31.93,15.62 v32.28,15.27
  Top_Signal 0.406: IC11.P$2 IC11.P$4 IC11.P$6 | IC11.P$6 IC11.P$8 | v3.26,3.87 3.23,1.27 J1.1 | J2.1 2.76,14.74 v2.78,16.84 | C13.2 v17.5,10.7 v17.49,10.69 | C14.1 v17.33,12.43 v17.32,12.44 | v17.48,20.55 18.19,20.55 C19.2 | IC9.P4 19.27,15.07 v19.28,15.06 | v32.29,15.28 v32.28,15.27 | IC10.P4 33.55,15.04 v33.56,14.97 | C20.2 v34.83,15.86 v34.82,15.85 | C15.1 21.48,13.34 v21.49,13.32 | C16.1 22.86,12.25 v22.8,12.24 | R30.2 27.16,18.26 R31.1 26.81,19.07 v26.49,18.75 25.96,18.22 R29.2 | R14.1 26.47,6.91 v26.47,7.57 | v15.35,9.45 IC11.P$6 | C5.2 27.02,12.22 v27.48,12.22 | IC6.2 v28.71,12.17 v28.7,12.18 | R24.1 7.93,21.84 v7.54,21.45 | R20.1 v6.6,10.81 | v17.12,15.01 17.12,15.51 IC9.P2 | R23.1 13.85,21.81 v14.38,21.28 | R19.1 15.09,0.79 v14.95,0.93
  Bottom_Signal 0.254: v26.24,13.21 26.3,13.21 C17.1
  other vias: 9.07,8.25 1.86,6.77 13.33,7.96 5.45,11.18 9.47,20.09 5.83,19.68 19.27,17.67 29.61,10.07 20.17,8.19 21.36,8.19 11.94,10.63
  pour GND: 16.7,0 16.7,6.7 30.7,6.7 30.7,14.3 35.7,14.3 35.7,24 0,24 0,0
  pour Bottom_Signal (isolate 0.254): 0,0 0,24 22,24 22,7.5 16.6,7.5 16.6,0
  pour Top_Signal (isolate 0.254): 30.5,7 30.5,15.1 35.5,15.1 35.5,20 28.5,20 28.5,14 26,14 26,7
  pour Top_Signal: 14,14 20,14 20,22 14,22
GPIO0  (via drill 0.3)
  Top_Signal 0.2: Q2.6 44.6,14.53 44.63,14.56 Q2.6 | 46.41,15.33 46.42,15.34 v46.42,15.8 v46.41,15.79 46.41,15.33 | v19.68,3.34 19.68,4.26 19.95,4.53 IC3.11 | 54.42,16.4 v54.25,16.57 54.75,16.07 IC1.23 | 46.41,15.33 46.41,15.3 46.26,15.15 45.01,15.15 44.62,14.76 Q2.6 | v28.05,6.44 v28.04,6.44 v26.77,5.17 | 46.41,15.33 46.83,15.33 47,15.5 47,16.52 v47.49,17.01
  Bottom_Signal 0.2: v46.42,15.8 45.94,16.28 42.56,16.28 42.12,16.72 41.03,16.72 39.59,15.28 39.59,13.49 40.56,12.52 40.56,11.27 39.79,10.5 38.46,10.5 37.86,11.1 36.1,11.1 34.6,9.6 32.8,9.6 32.64,9.44 29.37,9.44 28.05,8.12 v28.05,6.44 | v19.68,3.34 19.9,3.12 21.64,3.12 23.96,5.44 25.38,5.44 25.65,5.17 v26.77,5.17 | v54.25,16.57 53.38,17.44 51.15,17.44 50.69,17.9 48.38,17.9 v47.49,17.01
  Bottom_Signal 0.254: v19.68,3.34 19.76,3.26
GPIO2
  Top_Signal 0.2: IC1.22 55.27,15.35 55.27,16.38 54.15,17.5 54.15,19.72 53.42,20.45 52.56,20.45 JP1.12
  Top_Signal 0.254: IC1.22
GPIO4
  Top_Signal 0.2: IC1.24 54.25,15.64 53.62,16.27 53.62,18.66 51.58,20.7 49.77,20.7 JP1.11
GPIO5
  Top_Signal 0.254: IC1.34 51.55,10.25 50.9,9.6 50.9,9.03 R9.2
GPIO7  (via drill 0.3)
  Top_Signal 0.2: IC1.32 50.67,11.25 v49.88,12.04
  Bottom_Signal 0.2: 49.38,10.41 49.38,11.54 v49.88,12.04
  Bottom_Signal 0.254: 49.38,10.41 IC7.3
  Bottom_Signal 0.406: U$1.3 IC7.3
GPIO8  (via drill 0.3)
  Top_Signal 0.2: IC1.33 49.47,10.75 48.87,11.35 48.87,12.61 v48.5,12.98
  Bottom_Signal 0.2: IC7.5 U$1.5 IC7.5 48,15.5 48,13.48 v48.5,12.98
GPIO9
  Top_Signal 0.2: IC1.28 53.47,13.25
GPIO10  (via drill 0.3)
  Top_Signal 0.2: 53.02,12.75 v52.86,12.73 52.88,12.75 IC1.29
  Bottom_Signal 0.2: v52.86,12.73 52.74,12.58 52.74,11.11 51.91,10.28 IC7.1
GPIO11  (via drill 0.3)
  Top_Signal 0.2: IC1.30 53.29,12.25 53.17,12.13 51.92,12.13 50.61,13.44 v50.61,14.26
  Bottom_Signal 0.2: v50.61,14.26 50.61,15.57 IC7.7 U$1.7
GPIO12
  Top_Signal 0.2: IC1.18 57.25,17.48 55.97,18.76 JP1.14
GPIO13  (via drill 0.3)
  Top_Signal 0.2: IC1.20 56.25,16.07 56.05,16.27 56.05,17.42 v55.65,17.82 | JP1.10 46.64,22.12 48.71,20.05 51.32,20.05 52.22,19.15 52.22,18.5 v52.67,18.05
  Bottom_Signal 0.2: v52.67,18.05 54.61,18.06 55.41,18.06 v55.65,17.82
GPIO14  (via drill 0.3)
  Top_Signal 0.2: JP1.8 40.73,21.22 41.14,20.81 47.03,20.81 48.47,19.37 50.67,19.37 v51.21,18.83 51.49,18.55 51.47,16.15 51,15.68 SJ1.1 | IC1.17 57.75,18.04 v57.3,18.49
  Bottom_Signal 0.2: v51.21,18.83 51.64,19.24 56.55,19.24 v57.3,18.49
GPIO15
  Top_Signal 0.2: IC1.21 55.75,16.02 55.68,16.09 55.68,16.77 54.73,17.72 54.73,20.82 JP1.13
GPIO16
  Top_Signal 0.2: 53.69,14.77 IC1.25
GPIO17  (via drill 0.3)
  Top_Signal 0.2: IC1.27 52.61,13.75 v52.24,14.12
  Bottom_Signal 0.2: 50.63,10.1 IC7.2 50.63,12.52 v52.24,14.12
  Bottom_Signal 0.406: U$1.2 IC7.2
GPIO18  (via drill 0.3)
  Top_Signal 0.2: IC1.35 51.73,9.75 51.39,9.41 51.39,8.64 51.19,8.44 50.43,8.44 50,8.01 v50,6.96 | R16.1 22.46,3.77 IC3.16 22.46,5.73 v22.15,6.04
  Top_Signal 0.254: IC3.16 22.46,5.04
  Bottom_Signal 0.2: v22.15,6.04 22.43,6.32 24.55,6.32 25.02,6.79 26.76,6.79 27.84,5.71 28.64,5.71 28.85,5.92 28.85,6.41 28.64,6.62 28.64,7.92 29.72,9 33,9 33.2,9.2 39.02,9.2 40.44,7.78 40.44,6.96 40.82,6.58 43.32,6.58 44.54,5.36 46.28,5.36 47.08,6.16 49.76,6.16 50,6.4 v50,6.96
GPIO19  (via drill 0.3)
  Top_Signal 0.2: IC1.38 54.75,5.62 v54.61,5.48 | 24.32,5.74 24.32,4.87 v24.98,4.21
  Top_Signal 0.254: IC3.17 24.33,5.77 R15.1 24.32,5.74
  Bottom_Signal 0.2: v24.98,4.21 25.04,4.15 31.35,4.15 32.1,3.4 36.5,3.4 37.24,4.14 39.29,4.14 39.69,4.54 40.91,4.54 42.01,3.44 48.71,3.44 49.52,4.25 52.31,4.24 53.37,4.24 v54.61,5.48
GPIO21  (via drill 0.3)
  Top_Signal 0.2: JP1.16 61.32,22.12 63,20.44 63,17.91 62.66,17.57 62.66,15.42 61.95,14.71 v61.95,14.12 v61.94,14.11 | IC1.42 56.75,7.47 v56.96,7.23
  Bottom_Signal 0.2: v61.93,14.12 61.1,14.11 60.58,14.11 59.62,13.15 59.62,13.14 59.56,13.1 59.56,9.6 57.6,7.62 57.21,7.23 v56.96,7.23
  Bottom_Signal 0.254: v61.93,14.12 v61.94,14.11
GPIO22  (via drill 0.3)
  Top_Signal 0.2: IC1.39 55.25,5.79 v55.54,5.5
  Bottom_Signal 0.2: v55.54,5.5 56.36,6.32 56.36,7.64 56.89,8.17 57.34,8.17 59.14,9.98 59.14,13.52 60.36,14.73 60.36,15.96 60.6,16.2 60.6,16.75 60.25,17.1 60.25,18.05 59.35,18.95 58.7,18.95 58.3,18.55 58.3,17.95 57.5,17.15 56,17.15 55.4,16.55 55.4,15.9 54,14.5 54,10.15 53.55,9.7 52.6,9.7 51.91,9.01 U$1.1 51.91,8.96
GPIO23  (via drill 0.3)
  Top_Signal 0.2: IC1.36 52.98,9.25 v52.77,9.04 | IC3.8 18.1,5.77 17.79,5.46 17.79,2.74 19.07,1.46 v19.6,1.46 | v55.1,4.72 53,4.72 v51.46,6.26
  Bottom_Signal 0.2: v19.6,1.46 19.85,1.45 24.45,1.45 26.66,3.66 31.1,3.66 31.96,2.8 36.7,2.8 37.56,3.66 39.63,3.66 40.95,2.34 40.95,1.98 42.08,0.85 51.26,0.85 52,1.59 52,2.79 52.77,3.56 53.94,3.56 v55.1,4.72 | v52.77,9.04 53.4,8.41 53.4,7.77 53.09,7.46 52.66,7.46 v51.46,6.26
GPIO25  (via drill 0.3)
  Top_Signal 0.2: IC1.14 59.25,15.91 v59.86,16.52 | IC3.7 17.64,6.27 17.24,5.87 17.24,2.58 18.96,0.86 22.86,0.86 25.5,3.5 29.12,3.5 v30.34,4.72
  Bottom_Signal 0.2: v59.85,16.52 59.22,15.89 59.22,15.2 58.76,14.74 58.32,14.74 57.6,14.04 57.6,10.11 57.38,9.83 57.12,9.83 55.41,8.16 55.41,7.08 53.06,4.73 49.28,4.73 48.38,3.83 42.35,3.83 41.21,4.97 39.41,4.97 38.96,4.52 36.84,4.52 36.23,3.91 32.26,3.91 31.45,4.72 v30.34,4.72
  Bottom_Signal 0.254: v59.86,16.52 v59.85,16.52
GPIO26  (via drill 0.3)
  Top_Signal 0.2: IC1.15 58.75,16.51 v59.66,17.42 | IC3.10 19.46,4.57 19.1,4.21 19.1,3 20.32,1.78 22.08,1.78 23.27,2.97 v23.27,3.63
  Bottom_Signal 0.2: 59.66,17.4 58.65,16.39 58.65,15.48 58.37,15.2 58.21,15.2 57.11,14.1 56.74,14.1 56.4,13.76 56.4,9.68 56.16,9.44 56.15,9.44 54.93,8.22 54.93,7.32 52.86,5.25 49.18,5.25 48.23,4.3 44.26,4.3 43.2,5.36 39.29,5.36 38.92,4.99 36.65,4.99 36,4.34 32.56,4.34 32.45,4.45 32.45,4.46 31.93,4.98 31.93,4.99 31.64,5.28 29.51,5.28 28.83,4.6 28.44,4.6 25.63,4.59 25.42,4.8 24.44,4.8 v23.27,3.63
  Bottom_Signal 0.254: v59.66,17.42 59.66,17.4
GPIO27  (via drill 0.3)
  Top_Signal 0.2: IC1.16 58.25,17.4 v59.15,18.3 | IC3.9 18.96,5.6 v19.33,5.97
  Bottom_Signal 0.2: v19.33,5.97 19.94,5.36 23.13,5.36 23.65,5.88 24.7,5.88 25.2,6.38 26.51,6.38 26.65,6.24 26.65,6.23 27.96,4.97 28.57,4.97 29.27,5.67 32.13,5.67 32.29,5.51 32.29,5.5 32.96,4.83 35.8,4.83 36.48,5.51 38.89,5.51 39.11,5.73 43.45,5.73 44.38,4.8 47.6,4.8 48.49,5.69 52.57,5.69 54.39,7.51 54.39,8.36 56,9.93 56,14.09 56.39,14.49 56.93,14.49 58.12,15.68 58.12,16.6 58.87,17.35 58.87,17.77 59.15,18.05 v59.15,18.3
GPIO32  (via drill 0.3)  (1 unrouted)
  Top_Signal 0.2: JP1.6 35.71,22.12 38.04,19.79 46.13,19.79 47.83,18.09 49.37,18.09 v50.01,18.73 | IC1.12 60.33,15.19 61.44,16.3 61.44,18.73 v60.99,19.18
  Bottom_Signal 0.2: v50.01,18.73 51.08,19.79 | 51.09,19.78 51.22,19.79 60.38,19.79 v60.99,19.18
GPIO33
  Top_Signal 0.2: IC1.13 59.75,15.48 60.49,16.22 60.49,17 60.26,17.23 60.26,18.07 58.51,19.82 JP1.15
GPIO34  (via drill 0.3)
  Top_Signal 0.2: JP1.7 38.19,21.33 39.33,20.19 46.73,20.19 48.17,18.75 v48.72,18.75 | 61.87,20.25 62.62,19.5 62.62,18.3 62.21,17.89 62.21,15.56 61.31,14.66 61.31,14.06 61,13.75 IC1.10
  Top_Signal 0.254: 61.87,20.25 61.86,20.25 v61.8,20.31
  Bottom_Signal 0.2: v61.8,20.31 50.28,20.31 v48.72,18.75
GPIO35
  Top_Signal 0.2: JP1.9 44.5,23.35 59.04,23.35 59.83,22.56 59.83,21.12 61.24,19.71 61.48,19.71 62.11,19.08 62.11,18.49 61.83,18.21 61.83,15.9 60.93,15 60.93,14.43 60.75,14.25 IC1.11
L1_N  (via drill 0.3)
  Top_Signal 0.152: IC3.2 17.52,8.77 17.26,8.51 16.77,8.51 v16.53,8.75
  Bottom_Signal 0.152: C23.2 15.06,10.59 16.37,9.28 16.37,8.91 v16.53,8.75
L1_P  (via drill 0.3)
  Top_Signal 0.152: IC3.1 v17.19,9.27
  Bottom_Signal 0.152: C22.2 15.89,10.2 16.82,9.27 v17.19,9.27
L2/GPIO2
  Top_Signal 0.254: IC3.3 17.72,8.27 17.3,7.85 16.24,7.85 15.75,7.36 C26.2
L_N  (via drill 0.3)
  Top_Signal 0.152: IC9.P6 v18.01,18.45
  Bottom_Signal 0.152: v18.01,18.45 16.79,18.45 16.12,17.78 16.12,16.55 14.85,15.28 14.85,14.79 14.42,14.36 14.42,13.77 C23.1
L_P  (via drill 0.3)
  Top_Signal 0.152: v16.8,17.62 IC9.P1 16.8,19.58 16.88,19.66
  Bottom_Signal 0.152: v16.8,17.62 16.8,16.76 15.73,15.7 15.73,14.27 C22.1
LINE_IN_L  (via drill 0.3)
  Top_Signal 0.254: IC11.P$1 v4.98,12.03 | JP4.1 J1.2 12.49,1.41 12.6,1.52 14.54,1.52 14.81,1.79 15.71,1.79 R19.2 15.73,3.11 C26.1 14.91,3.13 13.79,4.25 13.79,5.33 12.11,7.01 7.98,7.01 7.16,6.19 5.83,6.19 v5.23,6.79
  Bottom_Signal 0.254: v4.98,12.03 4.08,11.13 4.08,7.94 v5.23,6.79
LINE_IN_R  (via drill 0.3)  (1 unrouted)
  Top_Signal 0.254: 14.59,11.94 14.59,11.41 14.42,11.24 9.47,11.24 8.76,10.53 8.76,9.68 C27.1 8.43,9.98 7.62,9.98 | 5.5,10 J1.3 | 5.63,8.27 J1.3 | R20.2 7.62,9.98 | 7.62,9.98 7.12,9.48 | 7.12,9.48 4.98,9.48 J1.3 | v8.55,5.8 7.71,4.96 JP4.2 | v7.15,8 7.15,9.45 7.12,9.48
  Bottom_Signal 0.254: v8.55,5.8 8.55,6.6 v7.15,8
LINE_OUT_L  (via drill 0.3)
  Top_Signal 0.254: 11.76,14.46 J2.2 | J2.2 12.26,14.64 12.26,15.91 | R23.2 15.3,21.84 v15.3,19.92 | IC11.P$7 16.12,12.75 15.3,13.57 13.33,13.57 J2.2 | J2.2 12.21,14.91 12.21,17.52 v12.53,17.84 | JP6.1 11.8,14.5 J2.2
  Bottom_Signal 0.254: v15.3,19.92 14.84,19.46 13.28,19.46 C28.- 13.19,18.83 13.23,18.79 13.23,18.31 12.76,17.84 v12.53,17.84
LINE_OUT_R  (via drill 0.3)
  Top_Signal 0.254: J2.3 6.87,22.2 R24.2 | R24.2 6.91,22.35 | IC11.P$5 15.36,12.63 15.07,12.92 9.29,12.92 JP7.1 6.9,15.31 6.9,22.13 R24.2 | v7.14,23.14 6.93,22.91 6.93,22.26 R24.2
  Bottom_Signal 0.254: v7.14,23.14 8.89,23.14 8.94,23.19
  Bottom_Signal 0.406: C29.- 9.37,22.76 8.94,23.19
LNA_IN
  Top_Signal 0.215: IC1.2 61.39,9.75 arc90 63.4,11.76 63.4,14.35 arc-90 C11.1
  Top_Signal 0.406: C11.1 arc90 C11.1 C12.1
LOUT1
  Top_Signal 0.254: IC3.30 19.96,12.59 19.39,13.16 16.68,13.16 R21.1
MICBIAS  (via drill 0.3)
  Top_Signal 0.254: IC3.32 18.96,9.83 | 18.96,9.74 18.96,9.83 | 18.96,9.83 18.95,9.84 18.06,9.84 v17.99,9.91
  Bottom_Signal 0.254: v17.99,9.91 17.85,10.09 17.02,10.09 16.58,10.54 16.58,11.06 16.99,11.47 18.72,11.47 20.01,12.76 20.01,13.49 21.54,15.02 25.17,15.02 C17.2
MONO_OUT  (via drill 0.3)
  Top_Signal 0.2: R30.1 28.24,17.96 28.24,17.47 27.76,16.99 26.17,16.99 v25.94,16.76
  Top_Signal 0.254: JP1.5 33.11,21.48 31.94,20.31 30.09,20.31 28.85,19.07 R31.2 | 28.25,19 R31.2 | R30.1 28.26,18.99 R31.2
  Bottom_Signal 0.2: C32.2 26.84,17.66 v25.94,16.76
N$1
  Top_Signal 0.254: R1.1 38.28,10.77
  Top_Signal 0.406: 38.28,10.77 D1.P$1
N$2
  Top_Signal 0.254: R0.2 40.28,10.72 D2.P$1
N$3
  cutout Top_Signal: 63.8,9.5 63.8,11 65.7,11 65.7,9.5
  cutout Top_Signal: 63.8,20.22 63.8,21.72 65.7,21.72 65.7,20.22
  cutout Top_Signal: 67.5,18.1 67.5,19.4 69.1,19.4 69.1,18.1
  cutout GND: 63.8,20.22 63.8,21.72 65.7,21.72 65.7,20.22
  cutout VCC: 63.8,20.22 63.8,21.72 65.7,21.72 65.7,20.22
  cutout Bottom_Signal: 63.8,20.22 63.8,21.72 65.7,21.72 65.7,20.22
  cutout VCC: 63.79,9.5 63.79,11 65.69,11 65.69,9.5
  cutout Bottom_Signal: 63.8,9.5 63.8,11 65.7,11 65.7,9.5
  cutout GND: 63.8,9.51 63.8,11.01 65.7,11.01 65.7,9.51
  cutout GND: 67.5,18.1 67.5,19.4 69.1,19.4 69.1,18.1
  cutout VCC: 67.5,18.1 67.5,19.4 69.1,19.4 69.1,18.1
  cutout Bottom_Signal: 67.5,18.1 67.5,19.4 69.1,19.4 69.1,18.1
N$8  (via drill 0.3)
  Top_Signal 0.254: R21.2 15.31,17.26 14.81,17.76 v13.74,17.76
  Bottom_Signal 0.254: v13.74,17.76 13.45,17.47 13.45,16.41 C28.+
N$9
  Top_Signal 0.2: IC2.8 43.27,6.35 43.75,5.87 44.14,5.87 44.45,5.56 R11.1 | R11.1 44.44,5.2 44.44,5.11 | R10.1 43.68,4.53 43.94,4.79 44.12,4.79 44.44,5.11 | R11.1 44.45,5.45 | 44.5,5.17 44.44,5.11 | R11.1 44.45,5.4
N$10  (via drill 0.3)
  Top_Signal 0.254: R22.2 11.13,22.25 10.77,21.89 10.77,20.87 v10.99,20.65
  Bottom_Signal 0.254: v10.99,20.65 11.49,20.65 12.55,21.71 12.55,22.04 C29.+
N$11  (via drill 0.3)
  Top_Signal 0.254: Q1.2 42.6,17.86 v42.82,17.64 | v33.3,12.74 32.94,12.38 D3.C
  Top_Signal 0.406: 34.8,9.28 F1.1 34.59,9.52 32.94,11.17 D3.C
  Bottom_Signal 0.254: v42.82,17.64 42.52,17.34 40.7,17.34 40.24,16.89 37.99,16.89 37.37,16.27 37.37,13.61 36.46,12.7 33.34,12.7 v33.3,12.74
N$12  (1 unrouted)
  Top_Signal 0.2: R5.1 46.64,16.98 47.24,17.58 47.98,17.58 48.48,17.08 48.48,15.86 SJ1.2
N$13
  Top_Signal 0.2: IC2.9 43.77,6.45 43.98,6.24 44.83,6.24 R12.1
N$23
  Top_Signal 0.254: IC3.18 24.84,6.27 R14.2
N$25  (via drill 0.3)
  Top_Signal 0.2: v25.81,15.37 26.21,15.37 R27.2
  Bottom_Signal 0.2: v25.81,15.37 25.9,15.28 26.63,15.28 C32.1
N$31
  Top_Signal 0.305: D4.P$1 51.84,8.95 R9.1
N$37
  Top_Signal 0.2: 21.46,11.59 C15.2
  Top_Signal 0.254: IC3.27 21.46,11.59
OUT4
  Top_Signal 0.254: IC3.21 23.83,7.77 24.39,8.33 24.39,13.4 24.94,13.95 24.95,13.96 25.27,14.28 27.69,14.28 28.24,14.83 28.24,16.43 R27.1
PROG
  Top_Signal 0.406: IC4.5 37.36,16.73 R3.1
R1_N  (via drill 0.3)
  Top_Signal 0.152: IC3.5 18.97,7.27 v19.17,7.07
  Bottom_Signal 0.152: v19.17,7.07 19.5,6.75 24.2,6.75 25.83,8.38 25.83,10.35 26.64,11.17 26.64,12.19 26.65,12.19 27.37,12.91 29.69,12.91 30.49,13.71 30.49,15.69 C25.2
R1_P  (via drill 0.3)
  Top_Signal 0.152: IC3.4 19.08,7.77 v19.17,7.86
  Bottom_Signal 0.152: v19.17,7.86 19.97,7.05 24.03,7.05 25.5,8.52 25.51,10.48 26.33,11.32 26.32,12.31 26.32,12.43 27.22,13.33 28.54,13.33 29.02,13.81 29.02,14.55 C24.2
R2/GPIO3  (via drill 0.3)
  Top_Signal 0.254: v14.5,6.72 14.5,8 13.31,9.19 12.21,9.19 11.75,9.65 C27.2 | IC3.6 v16.91,6.77
  Bottom_Signal 0.254: v16.91,6.77 16.32,6.18 15.04,6.18 v14.5,6.72
R_N  (via drill 0.3)
  Top_Signal 0.152: IC10.P6 32.21,19.3 32.21,18.52 v31.93,18.25
  Top_Signal 0.254: IC10.P6 32.35,19.3
  Bottom_Signal 0.152: C25.1 31.58,17.9 v31.93,18.25
R_P  (via drill 0.3)
  Top_Signal 0.152: IC10.P1 31.24,19.14 31.24,18.77 30.93,18.45 30.24,18.45 v29.46,18.45
  Bottom_Signal 0.152: C24.1 29.01,17.26 29.01,18 v29.46,18.45
RESET  (via drill 0.3)
  Top_Signal 0.2: JP2.2 55.97,2.85 | IC1.9 61.26,13.25 | 55.97,2.85 57.26,4.14 58.54,4.14 59.76,5.36 R32.1 60.1,6.18 v60.63,6.71 | C9.1 61.95,13.22 v61.96,13.23 | 55.97,2.85 55.97,2.87 | Q2.3 45.94,12.63 45.94,12.08 46.9,11.12 46.9,7.1 49.6,4.4 51.34,4.4 52.29,3.45 54.12,3.45 54.72,2.85 55.97,2.85
  Top_Signal 0.254: 61.26,13.25 C9.1
  Bottom_Signal 0.2: v61.96,13.23 61.46,12.73 60.33,12.73 59.95,12.35 59.94,12.35 59.94,8.38 60.63,7.69 v60.63,6.71
ROUT1  (via drill 0.3)
  Top_Signal 0.254: IC3.29 20.46,19.89 v20,20.35 | R22.1 13,23 v16.17,23
  Bottom_Signal 0.254: v16.17,23 18.66,20.51 19.84,20.51 v20,20.35
RTS
  Top_Signal 0.2: Q2.4 45.92,13.69 45.27,13.04 Q2.2 IC2.19
RXD  (via drill 0.3)
  Top_Signal 0.2: IC1.40 55.75,6.22 56.14,5.83 56.14,4.72 55.57,4.15 54.87,4.15 54.74,4.28 52.86,4.28 51.58,5.56 49.84,5.56 49.1,6.3 49.1,6.64 v48.91,6.83 | IC2.21 44.27,11.31 v43.76,11.82
  Bottom_Signal 0.2: v48.91,6.83 47.26,6.83 43.76,10.33 v43.76,11.82
SENS_VP  (via drill 0.3)
  Top_Signal 0.2: R4.1 46.68,3.49 S1.4 S1.3 50.66,3.14 50.8,3 53.91,3 54.55,2.36 54.55,1.13 54.99,0.69 56.82,0.69 57.31,1.18 57.31,2.9 57.98,3.57 59.61,3.57 v60.73,4.69 | IC1.5 61.05,11.25 v61.28,11.47
  Bottom_Signal 0.2: v61.28,11.47 60.91,11.47 60.43,10.99 60.43,8.97 61.32,8.08 61.32,6.06 60.73,5.47 v60.73,4.69
SPKR+
  Top_Signal 0.254: JP1.1 20.95,20.12 20.95,15.15 23.44,12.66 23.44,10.5 23.35,10.41 23.35,10.4 22.91,9.96 IC3.25
SPKR-
  Top_Signal 0.254: JP1.2 25.49,20.99 24.65,20.15 22.41,20.15 21.76,19.5 21.76,19.49 21.42,19.15 21.42,15.54 23.91,13.05 23.91,9 23.68,8.77 IC3.23 23.16,8.76 23.62,8.76
STAT  (via drill 0.3)
  Top_Signal 0.2: v40.16,9.87 39.67,9.87 39.2,10.34 39.2,10.5 D2.P$2 | IC4.1 41.48,16.73 42.15,16.06 42.15,11.59 v41.3,10.74
  Top_Signal 0.254: 40.9,16.73 41.01,16.76 IC4.1
  Bottom_Signal 0.2: v40.16,9.87 40.2,9.87 40.48,10.15 40.48,10.45 40.77,10.74 v41.3,10.74
TXD  (via drill 0.3)
  Top_Signal 0.2: IC2.20 44.77,11.66 v44.61,11.82 | IC1.41 56.25,6.48 56.77,5.96 56.77,4.64 55.92,3.79 55.92,3.78 55.72,3.58 54.66,3.58 54.39,3.85 52.68,3.85 51.56,4.97 49.73,4.97 47.55,7.15 47.55,11.2 47.39,11.36 47.39,12.04 v47.21,12.22
  Bottom_Signal 0.2: v44.61,11.82 44.61,12.06 45.04,12.49 46.94,12.49 v47.21,12.22
VBAT  (via drill 0.3)
  Top_Signal 0.254: 45.15,17.6 45.1,17.55 | Q1.3 43.33,18.39
  Top_Signal 0.305: IC4.3 41.35,18.63 41.97,19.25 43.09,19.25 43.31,19.03 Q1.3
  Top_Signal 0.406: 43.33,18.39 C3.1 45.1,17.55 45.1,16.28 v45.11,15.71 | JP2.1 52.93,1.8 51.85,0.72 45.45,0.72 44.5,1.67 J4.2 45.5,3.36 45.5,4 45.98,4.48 v45.98,6.1 v45.99,6.1 | R6.1 45.55,18 45.15,17.6
  Bottom_Signal 0.406: v45.99,6.1 46.07,6.14 45.29,6.92 43.91,6.92 43.19,7.42 43.18,7.42 43.03,7.57 43.06,13.72 v45.11,15.71
VBUS  (via drill 0.3)  (1 unrouted)
  Top_Signal 0.2: C7.2 42.21,5.33 42.21,5.32 42.43,5.1 43.43,5.1 43.71,5.38 R10.2 | 42.16,5.33 41.94,5.11 40.96,5.11 40.52,5.55 IC8.1
  Top_Signal 0.254: 42.34,18.64 42.07,18.37 42.07,17.12 42.92,16.27 v42.92,15.67 | J3.A9 35.95,6.99 35.7,6.74 J3.B4 35.7,5.13 35.45,4.88 33.56,4.88 33.2,5.24 J3.B9 33.2,6.79 32.95,7.04 J3.A4 D3.A | 42.21,5.33 42.16,5.33
  Top_Signal 0.305: 42.15,5.55 C7.2 | D3.A 31.58,9.34 C0.2
  Top_Signal 0.406: v39.88,12.02 v41.43,12.02 | C7.2 42.21,6.16 v41.21,7.16 | v36.37,12.01 36.15,11.76 R2.1 v34.01,11.05 | 36.15,11.79 v36.37,12.01 | v36.37,12.01 36.89,11.49 R1.2 | D3.A v32.95,10.19 v32.94,10.2
  Bottom_Signal 0.254: v42.92,15.67 42.92,15.11 42.42,14.61 42.42,11.67 41.99,11.24
  Bottom_Signal 0.406: v41.43,12.02 41.99,11.24 41.99,7.94 v41.21,7.16 | v36.37,12.01 v39.87,12.01 v39.88,12.02 | v34.01,11.05 33.79,11.05 v32.94,10.2
VCC  (via drill 0.3)
  Top_Signal 0.254: 19.45,9.95 19.45,9.4 19.75,9.1 21.67,9.1 21.96,9.39 IC3.26 21.96,10.56 22.13,10.73 C16.2 | 19.45,9.95 IC3.31 | 19.45,9.95 19.45,10.49 19.06,10.88 19.06,11.48 C13.1 19.02,12.41 C14.2
  Top_Signal 0.406: IC6.5 26.37,11.22 C5.1 26.38,10.65 26.7,10.33 v27.04,10.33 | IC9.P5 C19.1 19.2,20.92 v18.72,21.4 | 34.86,17.57 C20.1 34.8,17.51 v33.91,17.51 33.49,17.93 IC10.P5 | v18.28,10.72 18.28,11.23 18.48,11.43 18.93,11.43 C13.1 | C16.2 v22.81,11.23
  pour VCC (isolate 0.254, rank 2): 16.3,0 16.3,7 29.9,7 29.9,14.8 35.3,14.8 35.3,24 0,24 0,0
VDD  (via drill 0.3)
  Top_Signal 0.2: 58.75,7.38 C34.2 | C6.1 42.96,5.54 43,5.5 | v43.54,1.59 43.51,1.62 43.51,2.84 44,3.33 44.7,3.33 45.01,3.64 45.01,4.31 45.23,4.53 R12.2
  Top_Signal 0.254: IC1.3 IC1.4 60.84,10.75 v61.17,10.42 | IC1.46 58.75,7.38 59.8,7.38 | IC1.1 60.33,7.8 59.91,7.38 59.8,7.38 | C8.1 53.46,8.21 54.06,8.21 54.25,8.4 IC1.37 | C34.2 57.86,7.38 C33.2 57.25,7.91 IC1.43 | R16.2 C21.2 20.96,4.27 IC3.13 IC3.14 | IC1.19 56.75,16.44 v56.69,16.5 | R32.2 59.76,7.34 59.8,7.38 | IC2.7 IC2.6 IC2.5 v41.16,8.13 | IC2.7 42.77,6.62 | 43,5.5 43,6.01 42.77,6.24 IC2.7
  Top_Signal 0.305: v41.16,8.13 v41.15,8.12
  Top_Signal 0.406: R4.2 47.28,5.51 v47.35,5.59 | 39.92,14.82 IC5.5 C4.1 v41.34,15.84 v41.34,15.85 | v52.69,8.14 53.39,8.14 C8.1 | v20.44,4.17 21.06,4.17 C21.2 | R15.2 26.06,5.65 v26.12,5.73 | C33.2 57.97,6.69 57.81,6.53 57.32,6.53 57.24,6.45 v57.22,6.45 | JP2.3 58.51,2.08 v59.35,2.92
  pour VCC (isolate 0.254, rank 2): 17.2,0 17.2,6.3 31,6.3 31,13.5 36.5,13.5 36.5,24 63,24 63,0
VDDSDIO  (via drill 0.3)
  Top_Signal 0.254: IC1.26 53.08,14.25 52.88,14.45 v52.88,15.33
  Bottom_Signal 0.305: 51.91,15.98 C10.1 52.52,16.93 52.88,16.57 v52.88,15.33
  Bottom_Signal 0.406: IC7.8 U$1.8 51.91,15.98
VREG_IN  (via drill 0.3)
  Top_Signal 0.254: IC4.4 38.98,18.63 38.97,18.62 37.01,18.62 v36.55,18.16 | IC5.3 37.47,13.2 37.47,12.59 37.8,12.26 38.74,12.26 39.24,11.76 39.24,11.26 | v34.74,13.35 F1.2
  Top_Signal 0.406: 37.24,13.22 IC5.3 37.41,13.14 35.89,13.14 35.07,12.32 F1.2 | IC5.1 36.52,15.1 36.31,14.89 C1.1 34.92,14.89 33.57,13.54 | 39.24,11.26 R0.1 | IC6.3 30.15,13.12 31.26,14.23 32.33,14.23 33.03,13.53 | F1.2 34.74,12.37 33.57,13.54 | 33.03,13.53 33.56,13.53 33.57,13.54 | IC6.1 30.52,11.23 31.09,11.8 C2.1 31.71,11.8 32.22,12.31 32.22,12.72 33.03,13.53
  Bottom_Signal 0.254: v34.74,13.35 34.74,14.35 36.46,16.07 36.46,18.07 v36.55,18.16

### Text on the board
tNames: IC11 | - | +
Top_Silk: AUDIO | OUT | VCC | + | - | L | R | MN | 32 | 34 | 14 | 35 | 13 | 4 | 2 | 15 | 12 | 33 | 21 | SPKR | BT_LVL | AUDIO | IN | IO36 | BATT | VIN | RST | VDD | GND | - | + | PICO DSP